# EAGLE design FY (EAGLE 9.6.2)

## Sheet 1 of 7
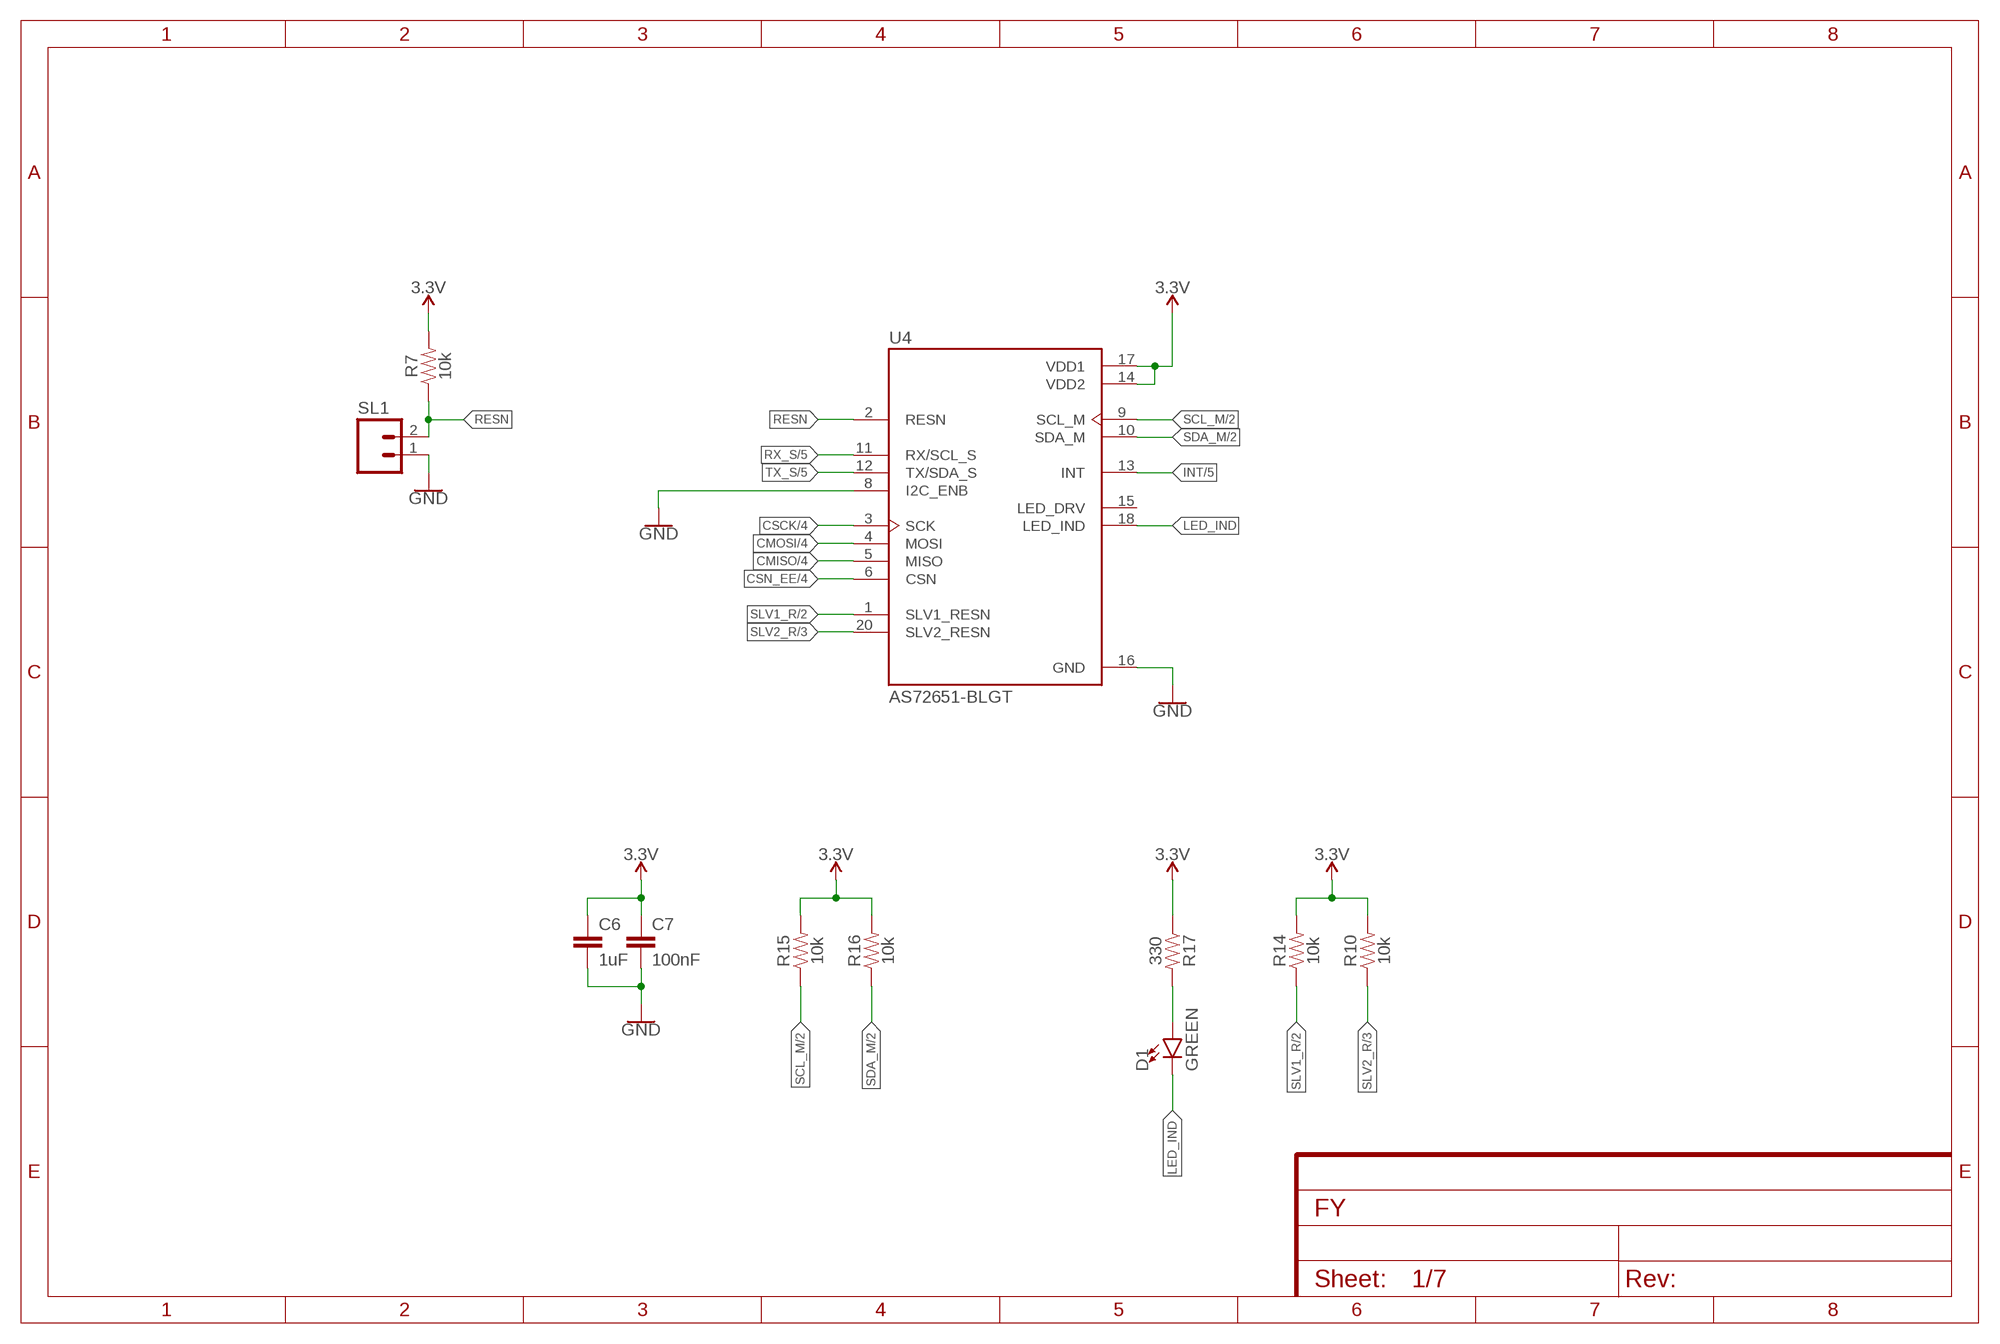
[diagram p0: schematic, sheet 1]

### Parts
C6  1uF  10UF-0603-6.3V-20%  [0603]
C7  100nF  0.1UF-0603-25V-(+80/-20%)  [0603]
D1  GREEN  LED-GREEN0603  [LED-0603]
R7  10k  10KOHM-0603-1/10W-1%  [0603]
R10  10k  10KOHM-0603-1/10W-1%  [0603]
R14  10k  10KOHM-0603-1/10W-1%  [0603]
R15  10k  10KOHM-0603-1/10W-1%  [0603]
R16  10k  10KOHM-0603-1/10W-1%  [0603]
R17  330  10KOHM-0603-1/10W-1%  [0603]
SL1  M02  [02P]
U4  AS72651-BLGT  [PQFN65P470X450X270-20N]

### Nets
3.3V [Power]: C6.1 C7.1 R7.2 R10.2 R14.2 R15.2 R16.2 R17.1 U4.14(VDD2) U4.17(VDD1) ; also sheet 2,3,4,5,6,7
CMISO: U4.5(MISO) ; also sheet 4
CMOSI: U4.4(MOSI) ; also sheet 4
CSCK: U4.3(SCK) ; also sheet 4
CSN_EE: U4.6(CSN) ; also sheet 4
GND: C6.2 C7.2 SL1.1 U4.8(I2C_ENB) U4.16(GND) ; also sheet 2,3,4,5,6,7
INT: U4.13(INT) ; also sheet 5
LED_IND: D1.C U4.18(LED_IND)
N$14: D1.A R17.2
RESN: R7.1 SL1.2 U4.2(RESN)
RX_S: U4.11(RX/SCL_S) ; also sheet 5
SCL_M: R15.1 U4.9(SCL_M) ; also sheet 2,3
SDA_M: R16.1 U4.10(SDA_M) ; also sheet 2,3
SLV1_R: R14.1 U4.1(SLV1_RESN) ; also sheet 2
SLV2_R: R10.1 U4.20(SLV2_RESN) ; also sheet 3
TX_S: U4.12(TX/SDA_S) ; also sheet 5
Unconnected: U4.15(LED_DRV)

## Sheet 2 of 7
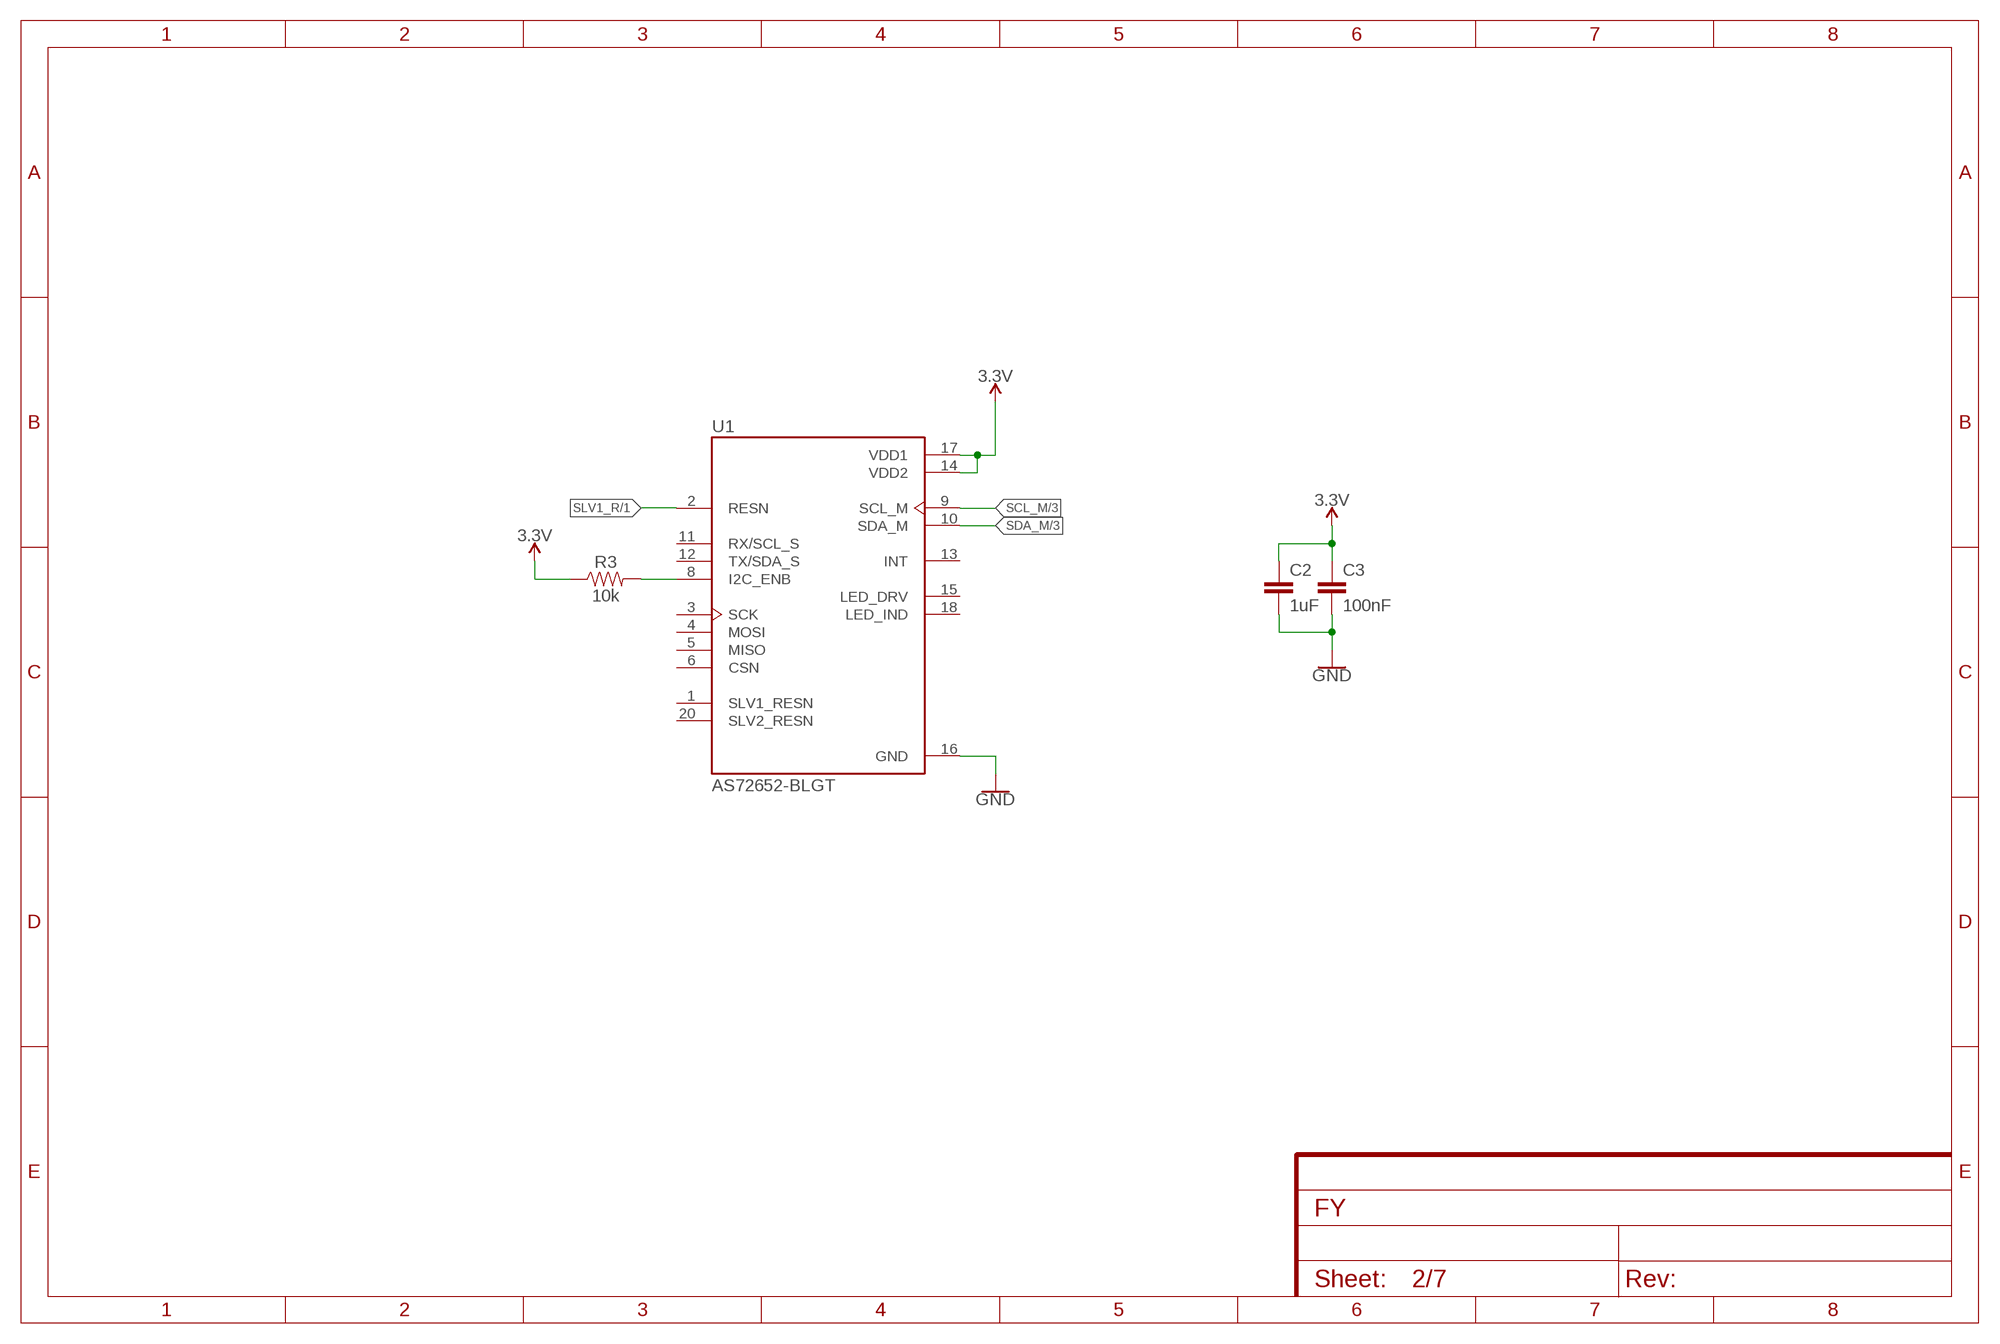
[diagram p1: schematic, sheet 2]

### Parts
C2  1uF  10UF-0603-6.3V-20%  [0603]
C3  100nF  0.1UF-0603-25V-(+80/-20%)  [0603]
R3  10k  0.05OHM-0603-1/5W-1%  [0603]
U1  AS72652-BLGT  AS72651-BLGT  [PQFN65P470X450X270-20N]

### Nets
3.3V [Power]: C2.1 C3.1 R3.1 U1.14(VDD2) U1.17(VDD1) ; also sheet 1,3,4,5,6,7
GND: C2.2 C3.2 U1.16(GND) ; also sheet 1,3,4,5,6,7
N$1: R3.2 U1.8(I2C_ENB)
SCL_M: U1.9(SCL_M) ; also sheet 1,3
SDA_M: U1.10(SDA_M) ; also sheet 1,3
SLV1_R: U1.2(RESN) ; also sheet 1
Unconnected: U1.1(SLV1_RESN) U1.3(SCK) U1.4(MOSI) U1.5(MISO) U1.6(CSN) U1.11(RX/SCL_S) U1.12(TX/SDA_S) U1.13(INT) U1.15(LED_DRV) U1.18(LED_IND) U1.20(SLV2_RESN)

## Sheet 3 of 7
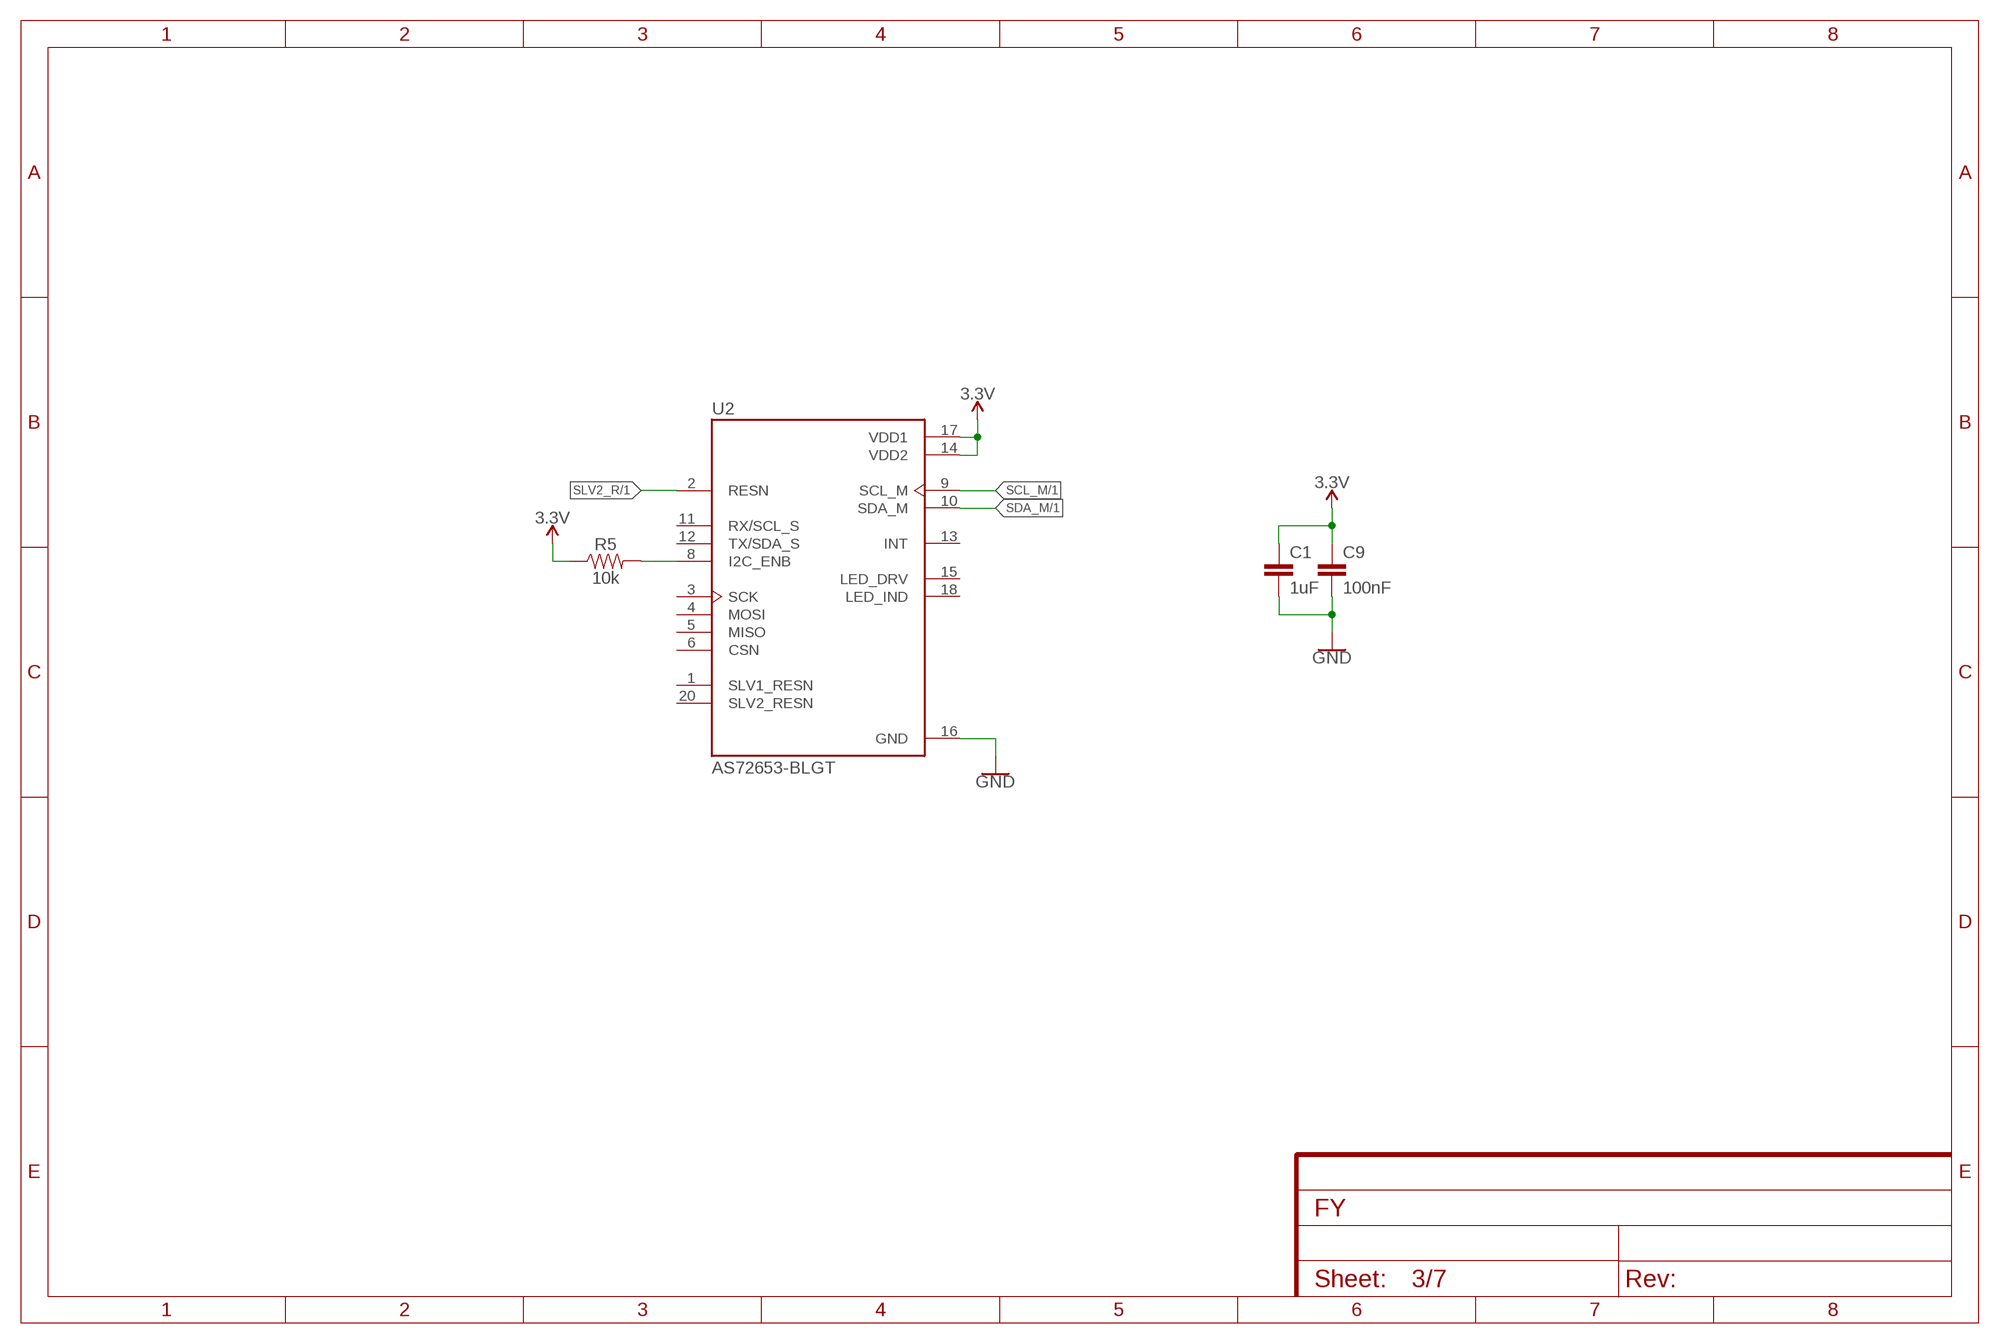
[diagram p2: schematic, sheet 3]

### Parts
C1  1uF  10UF-0603-6.3V-20%  [0603]
C9  100nF  0.1UF-0603-25V-(+80/-20%)  [0603]
R5  10k  0.05OHM-0603-1/5W-1%  [0603]
U2  AS72653-BLGT  AS72651-BLGT  [PQFN65P470X450X270-20N]

### Nets
3.3V [Power]: C1.1 C9.1 R5.1 U2.14(VDD2) U2.17(VDD1) ; also sheet 1,2,4,5,6,7
GND: C1.2 C9.2 U2.16(GND) ; also sheet 1,2,4,5,6,7
N$5: R5.2 U2.8(I2C_ENB)
SCL_M: U2.9(SCL_M) ; also sheet 1,2
SDA_M: U2.10(SDA_M) ; also sheet 1,2
SLV2_R: U2.2(RESN) ; also sheet 1
Unconnected: U2.1(SLV1_RESN) U2.3(SCK) U2.4(MOSI) U2.5(MISO) U2.6(CSN) U2.11(RX/SCL_S) U2.12(TX/SDA_S) U2.13(INT) U2.15(LED_DRV) U2.18(LED_IND) U2.20(SLV2_RESN)

## Sheet 4 of 7
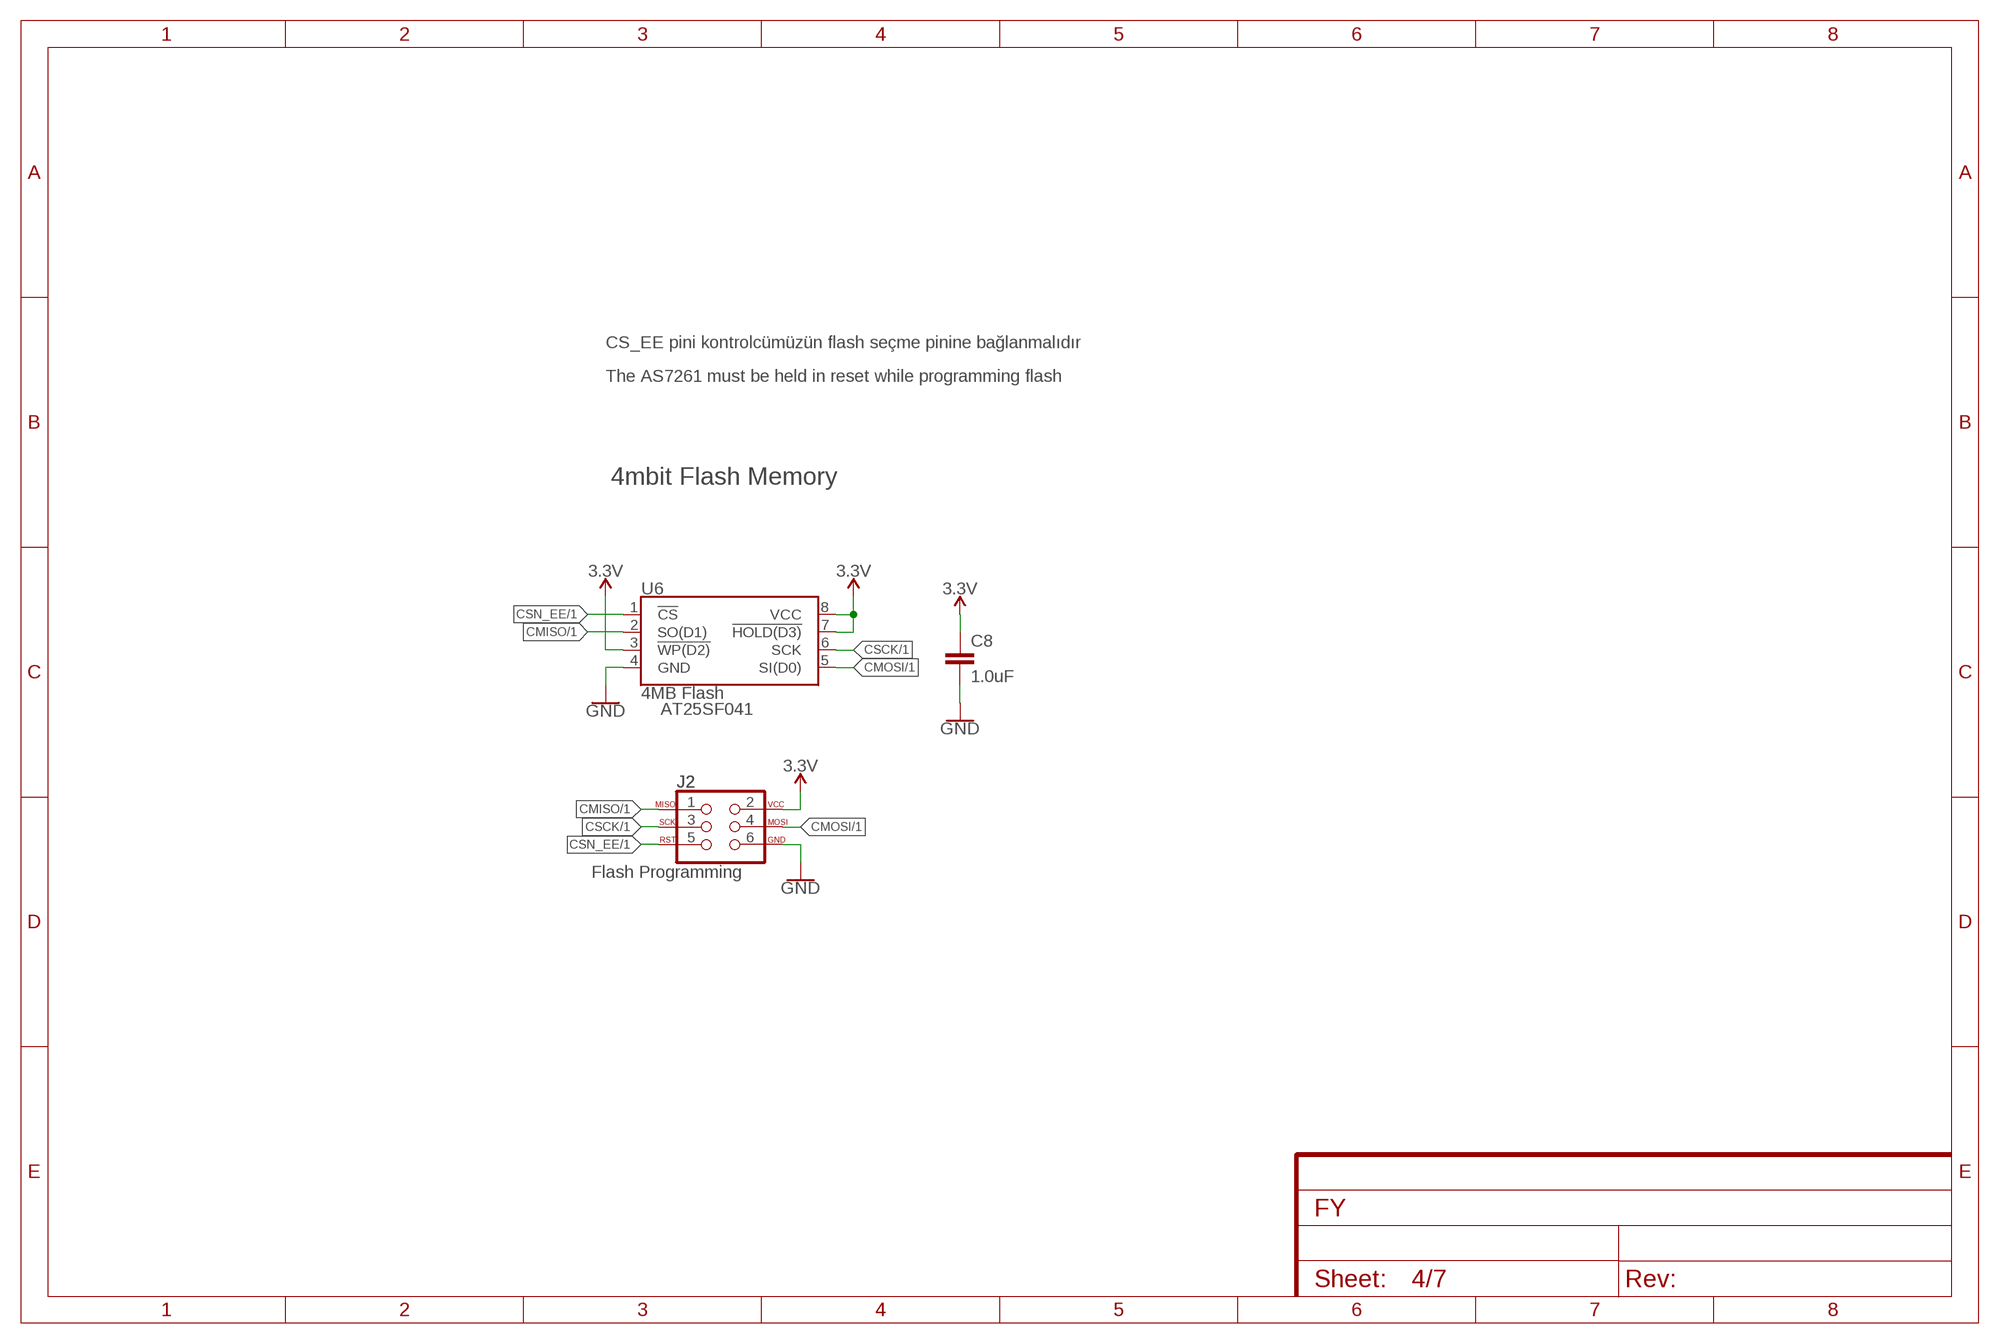
[diagram p3: schematic, sheet 4]

### Parts
C8  1.0uF  1.0UF-0603-16V-10%  [0603]
J2  Flash Programming  AVR_SPI_PROG_3X2TESTPOINTS  [2X3_TEST_POINTS]
U6  4MB Flash  AT25SF041  [SO08]

### Nets
3.3V [Power]: C8.1 J2.2 U6.3(!WP(D2)) U6.7(!HOLD(D3)) U6.8(VCC) ; also sheet 1,2,3,5,6,7
CMISO: J2.1 U6.2(SO(D1)) ; also sheet 1
CMOSI: J2.4 U6.5(SI(D0)) ; also sheet 1
CSCK: J2.3 U6.6(SCK) ; also sheet 1
CSN_EE: J2.5 U6.1(!CS) ; also sheet 1
GND: C8.2 J2.6 U6.4(GND) ; also sheet 1,2,3,5,6,7

### Notes on the sheet
- CS_EE pini kontrolcümüzün flash seçme pinine bağlanmalıdır
- The AS7261 must be held in reset while programming flash
- 4mbit Flash Memory
- AT25SF041

## Sheet 5 of 7
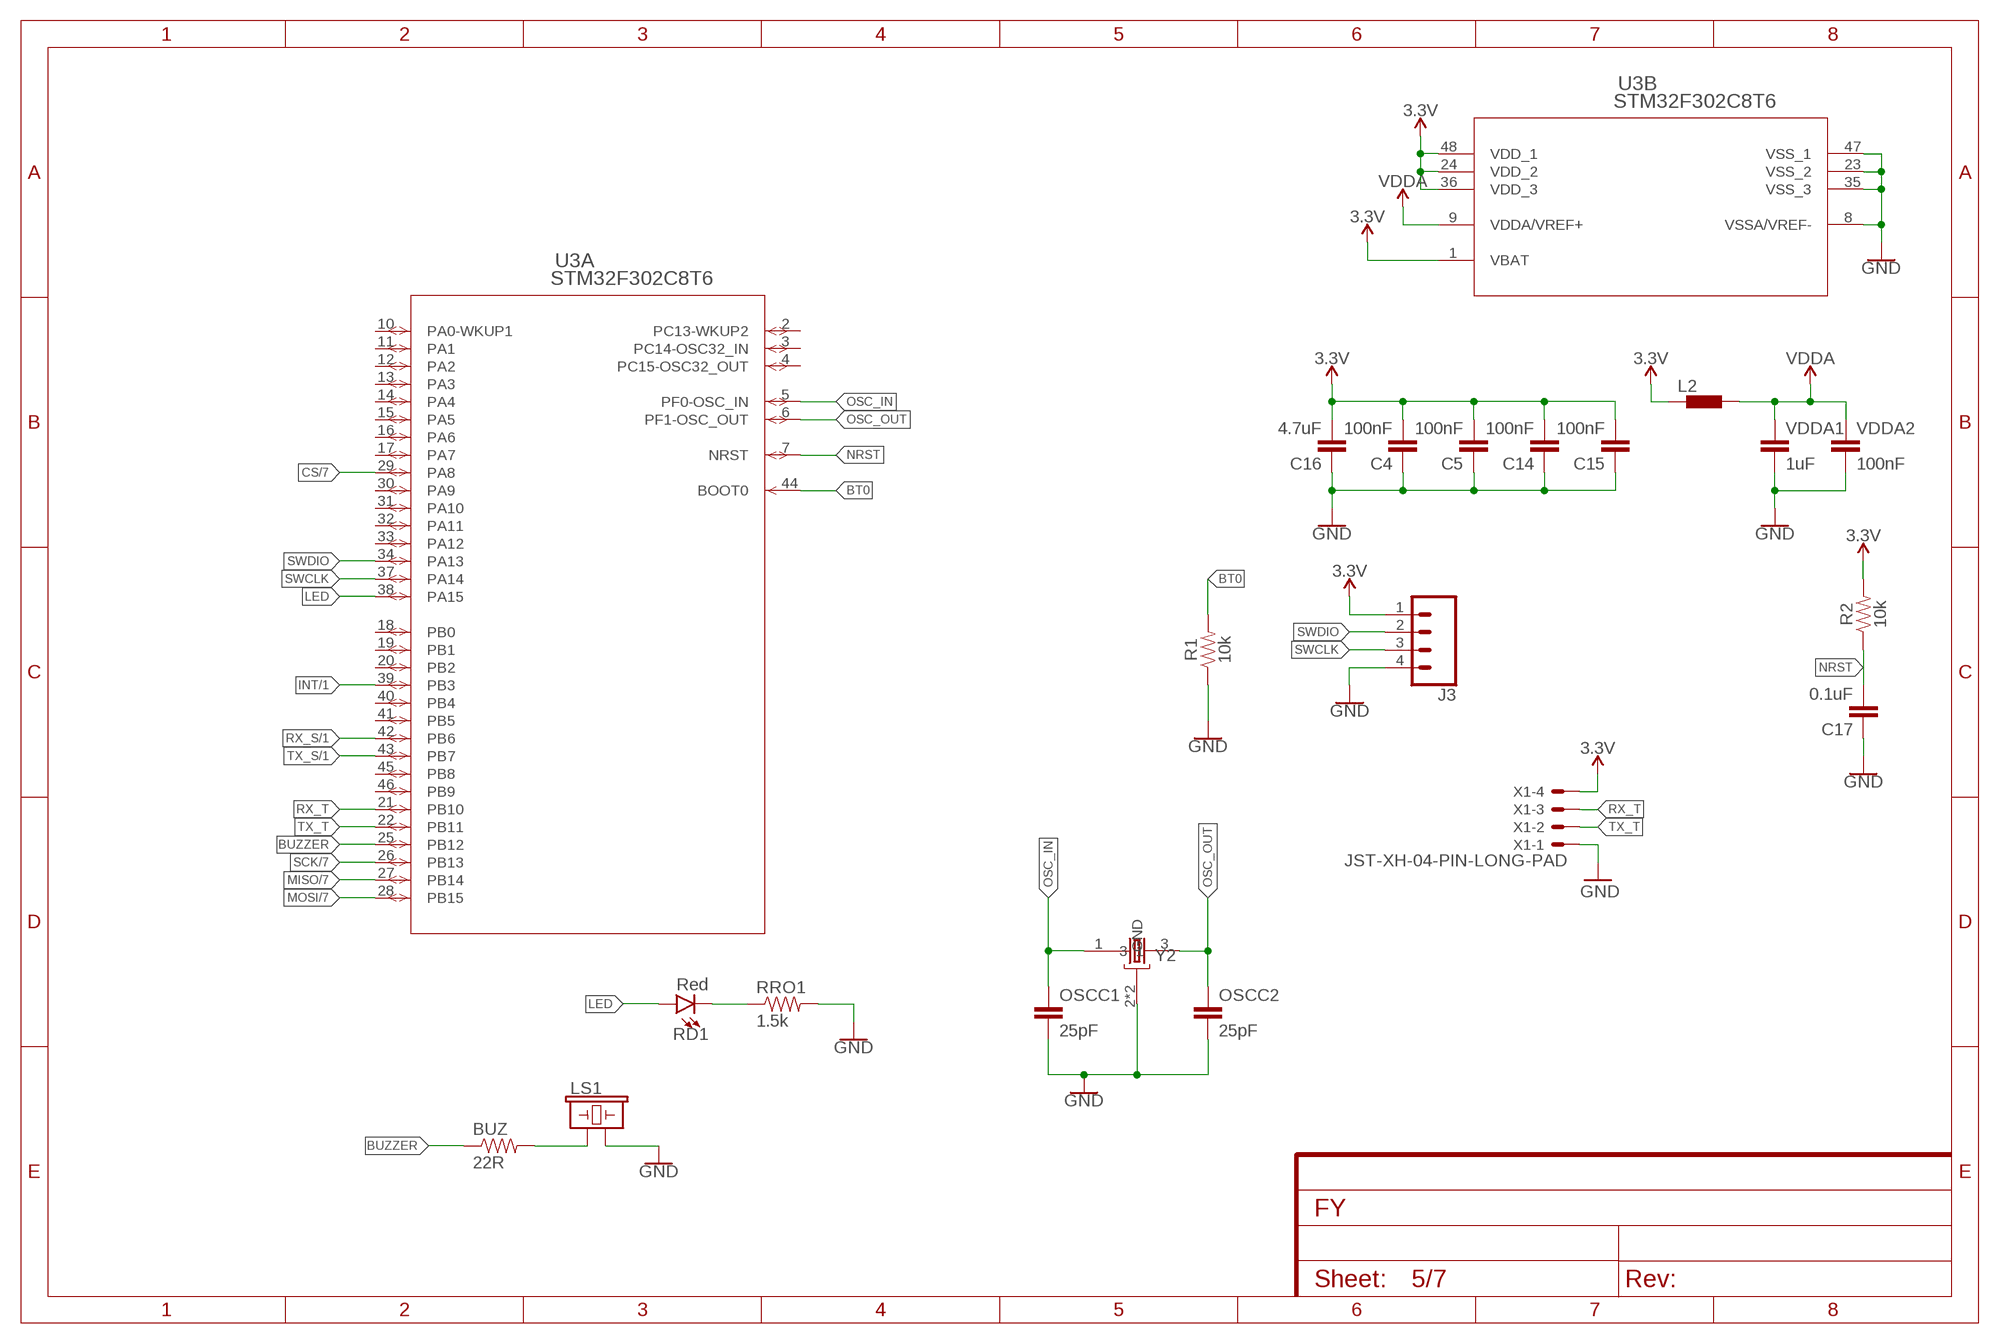
[diagram p4: schematic, sheet 5]

### Parts
BUZ  22R  2.0KOHM1/10W5%(0603)  [0603-RES]
C4  100nF  22PF-0603-50V-5%  [0603]
C5  100nF  22PF-0603-50V-5%  [0603]
C14  100nF  22PF-0603-50V-5%  [0603]
C15  100nF  22PF-0603-50V-5%  [0603]
C16  4.7uF  22PF-0603-50V-5%  [0603]
C17  0.1uF  22PF-0603-50V-5%  [0603]
J3  CONN_04  [1X04]
L2  BLM15HB221SN1  [0402]
LS1  BUZZER-PTH  [BUZZER-12MM]
OSCC1  25pF  0.1UF-0603-25V-(+80/-20%)  [0603]
OSCC2  25pF  0.1UF-0603-25V-(+80/-20%)  [0603]
R1  10k  0.05OHM-0603-1/5W-1%  [0603]
R2  10k  0.05OHM-0603-1/5W-1%  [0603]
RD1  Red  LED-RED0603-SMART  [LED-0603]
RRO1  1.5k  2.0KOHM1/10W5%(0603)  [0603-RES]
U3  STM32F302C8T6  [LQFP48-7X7MM]
VDDA1  1uF  0.1UF-0603-25V-(+80/-20%)  [0603]
VDDA2  100nF  0.1UF-0603-25V-(+80/-20%)  [0603]
X1  JST-XH-04-PIN-LONG-PAD  [JST-XH-04-PACKAGE-LONG-PAD]
Y2  ABM2B-8.000MHZ-10-1-U-T  ABM3B-26.000MHZ-10-1-U-T  [OSCCC500X320X110-4N]

### Nets
3.3V [Power]: C4.2 C5.2 C14.2 C15.2 C16.2 J3.1 L2.1 R2.2 U3.1(B:VBAT) U3.24(B:VDD_2) U3.36(B:VDD_3) U3.48(B:VDD_1) X1.4 ; also sheet 1,2,3,4,6,7
BT0: R1.2 U3.44(A:BOOT0)
BUZZER: BUZ.1 U3.25(A:PB12)
CS: U3.29(A:PA8) ; also sheet 7
GND: C4.1 C5.1 C14.1 C15.1 C16.1 C17.1 J3.4 LS1.- OSCC1.2 OSCC2.2 R1.1 RRO1.2 U3.8(B:VSSA/VREF-) U3.23(B:VSS_2) U3.35(B:VSS_3) U3.47(B:VSS_1) VDDA1.2 VDDA2.2 X1.1 Y2.2(GND) Y2.4(GND) ; also sheet 1,2,3,4,6,7
INT: U3.39(A:PB3) ; also sheet 1
LED: RD1.A U3.38(A:PA15)
MISO: U3.27(A:PB14) ; also sheet 7
MOSI: U3.28(A:PB15) ; also sheet 7
N$2: RD1.C RRO1.1
N$13: BUZ.2 LS1.+
NRST: C17.2 R2.1 U3.7(A:NRST)
OSC_IN: OSCC1.1 U3.5(A:PF0-OSC_IN) Y2.1
OSC_OUT: OSCC2.1 U3.6(A:PF1-OSC_OUT) Y2.3
RX_S: U3.42(A:PB6) ; also sheet 1
RX_T: U3.21(A:PB10) X1.3
SCK: U3.26(A:PB13) ; also sheet 7
SWCLK: J3.3 U3.37(A:PA14)
SWDIO: J3.2 U3.34(A:PA13)
TX_S: U3.43(A:PB7) ; also sheet 1
TX_T: U3.22(A:PB11) X1.2
VDDA: L2.2 U3.9(B:VDDA/VREF+) VDDA1.1 VDDA2.1
Unconnected: U3.2(A:PC13-WKUP2) U3.3(A:PC14-OSC32_IN) U3.4(A:PC15-OSC32_OUT) U3.10(A:PA0-WKUP1) U3.11(A:PA1) U3.12(A:PA2) U3.13(A:PA3) U3.14(A:PA4) U3.15(A:PA5) U3.16(A:PA6) U3.17(A:PA7) U3.18(A:PB0) U3.19(A:PB1) U3.20(A:PB2) U3.30(A:PA9) U3.31(A:PA10) U3.32(A:PA11) U3.33(A:PA12) U3.40(A:PB4) U3.41(A:PB5) U3.45(A:PB8) U3.46(A:PB9)

## Sheet 6 of 7
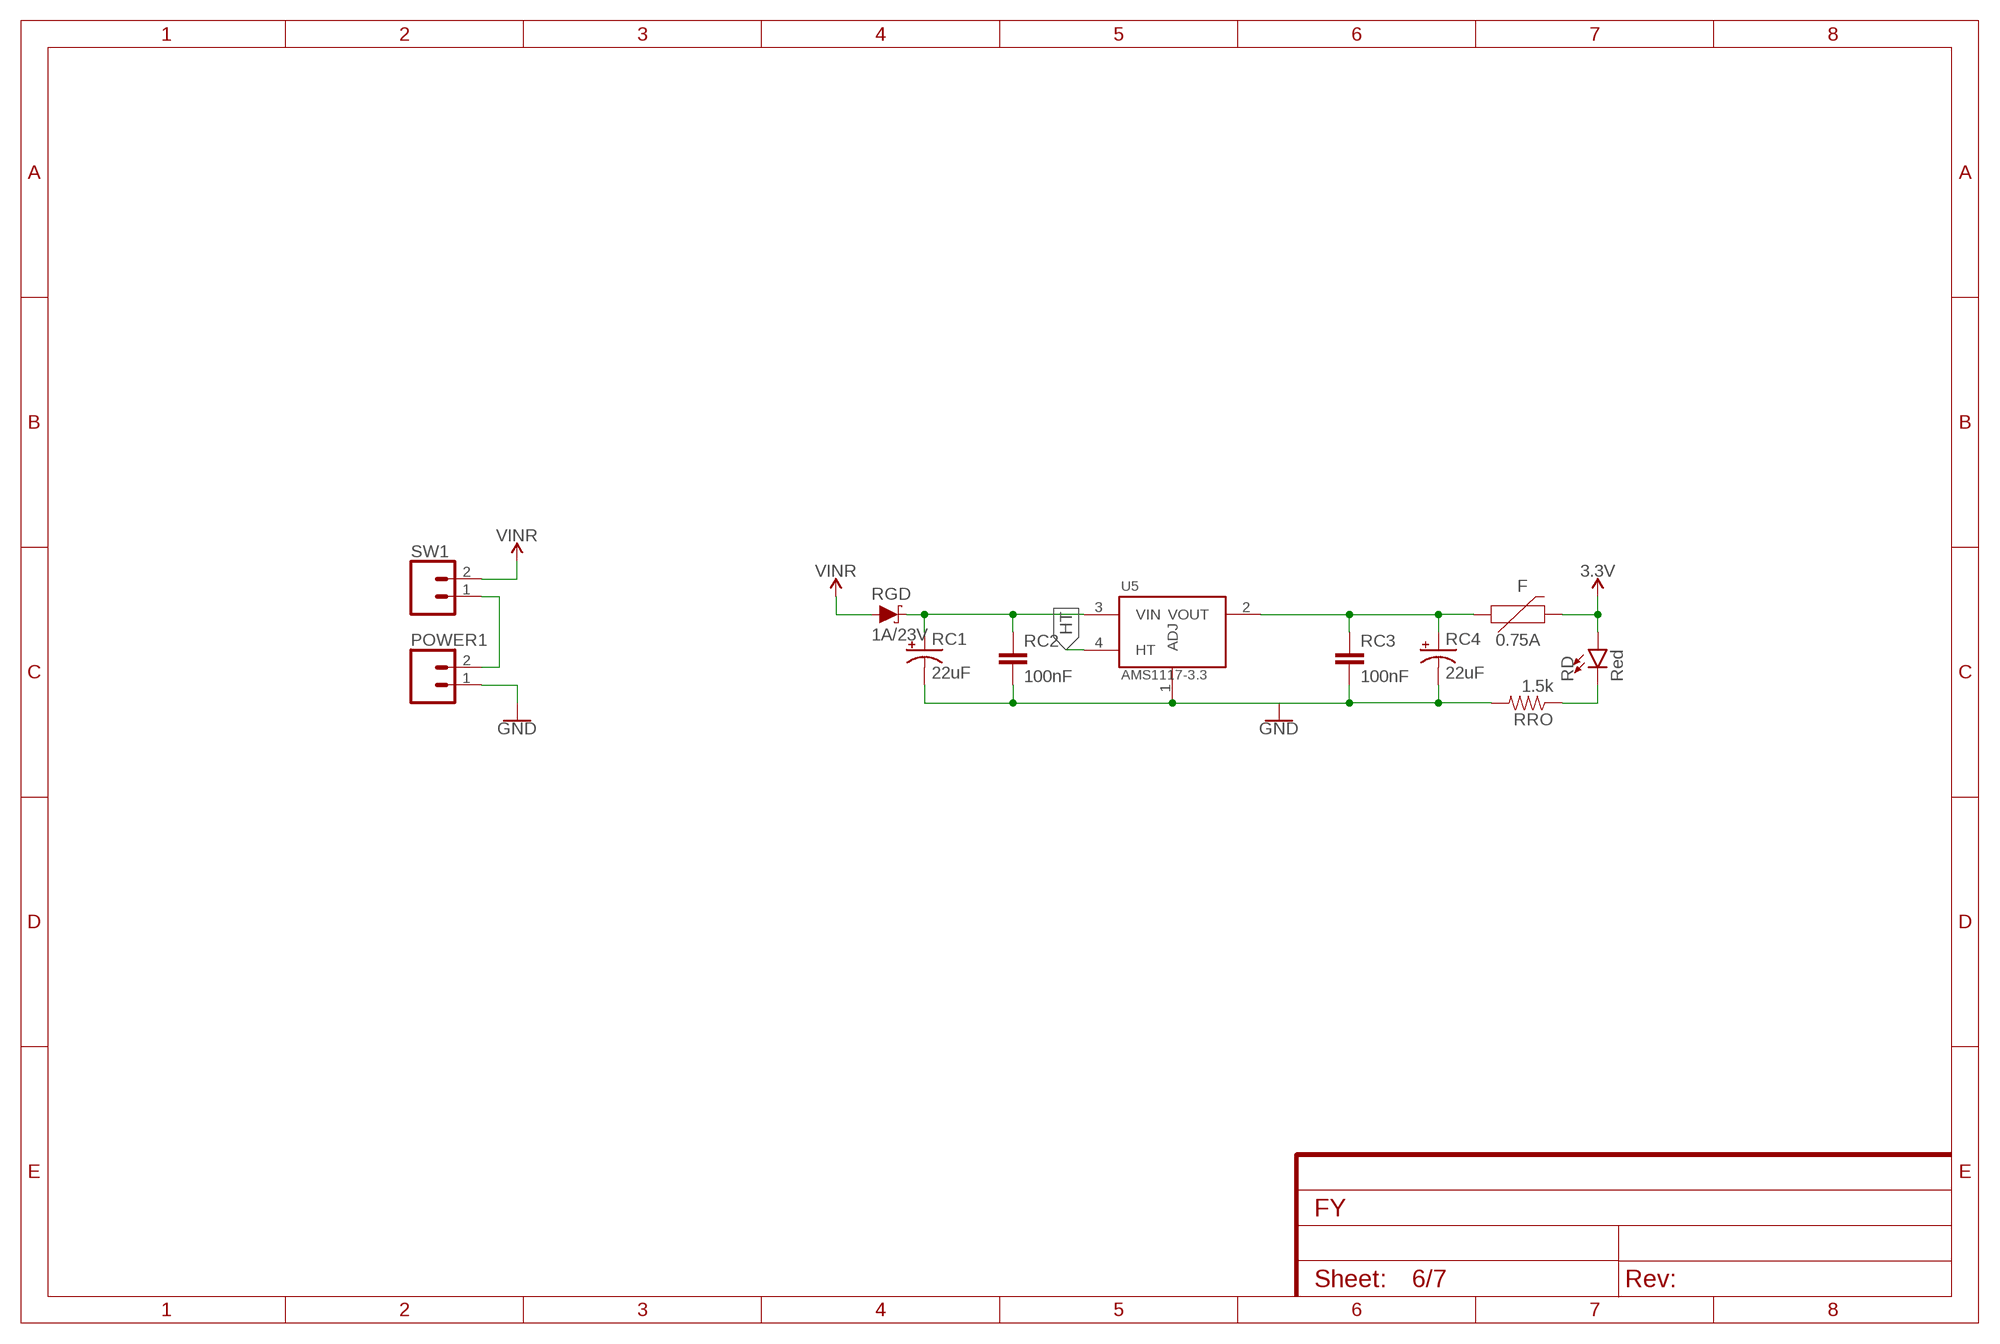
[diagram p5: schematic, sheet 6]

### Parts
F  0.75A  PPTC_THREE-QUARTER-AMP  [1206]
POWER1  CONN_023.5MM-NO_SILK  [SCREWTERMINAL-3.5MM-2-NS]
RC1  22uF  10UF-POLAR-EIA3528-20V-10%(TANT)  [EIA3528]
RC2  100nF  0.1UF-0603-25V-(+80/-20%)  [0603]
RC3  100nF  0.1UF-0603-25V-(+80/-20%)  [0603]
RC4  22uF  10UF-POLAR-EIA3528-20V-10%(TANT)  [EIA3528]
RD  Red  LED-RED0603-SMART  [LED-0603]
RGD  1A/23V  DIODE-SCHOTTKY-BAT20J  [SOD-323]
RRO  1.5k  2.0KOHM1/10W5%(0603)  [0603-RES]
SW1  CONN_023.5MM-NO_SILK  [SCREWTERMINAL-3.5MM-2-NS]
U5  AMS1117-3.3  [SOT229P700X180-4N]

### Nets
3.3V [Power]: F.2 RD.A ; also sheet 1,2,3,4,5,7
GND: POWER1.1 RC1.C(-) RC2.2 RC3.2 RC4.C(-) RRO.2 U5.1(ADJ) ; also sheet 1,2,3,4,5,7
HT: U5.4(HT)
N$3: POWER1.2 SW1.1
N$6: F.1 RC3.1 RC4.A(+) U5.2(VOUT)
N$11: RD.C RRO.1
VIN: RGD.A SW1.2 ; supply symbol labelled VINR
VNR: RC1.A(+) RC2.1 RGD.C U5.3(VIN)

## Sheet 7 of 7
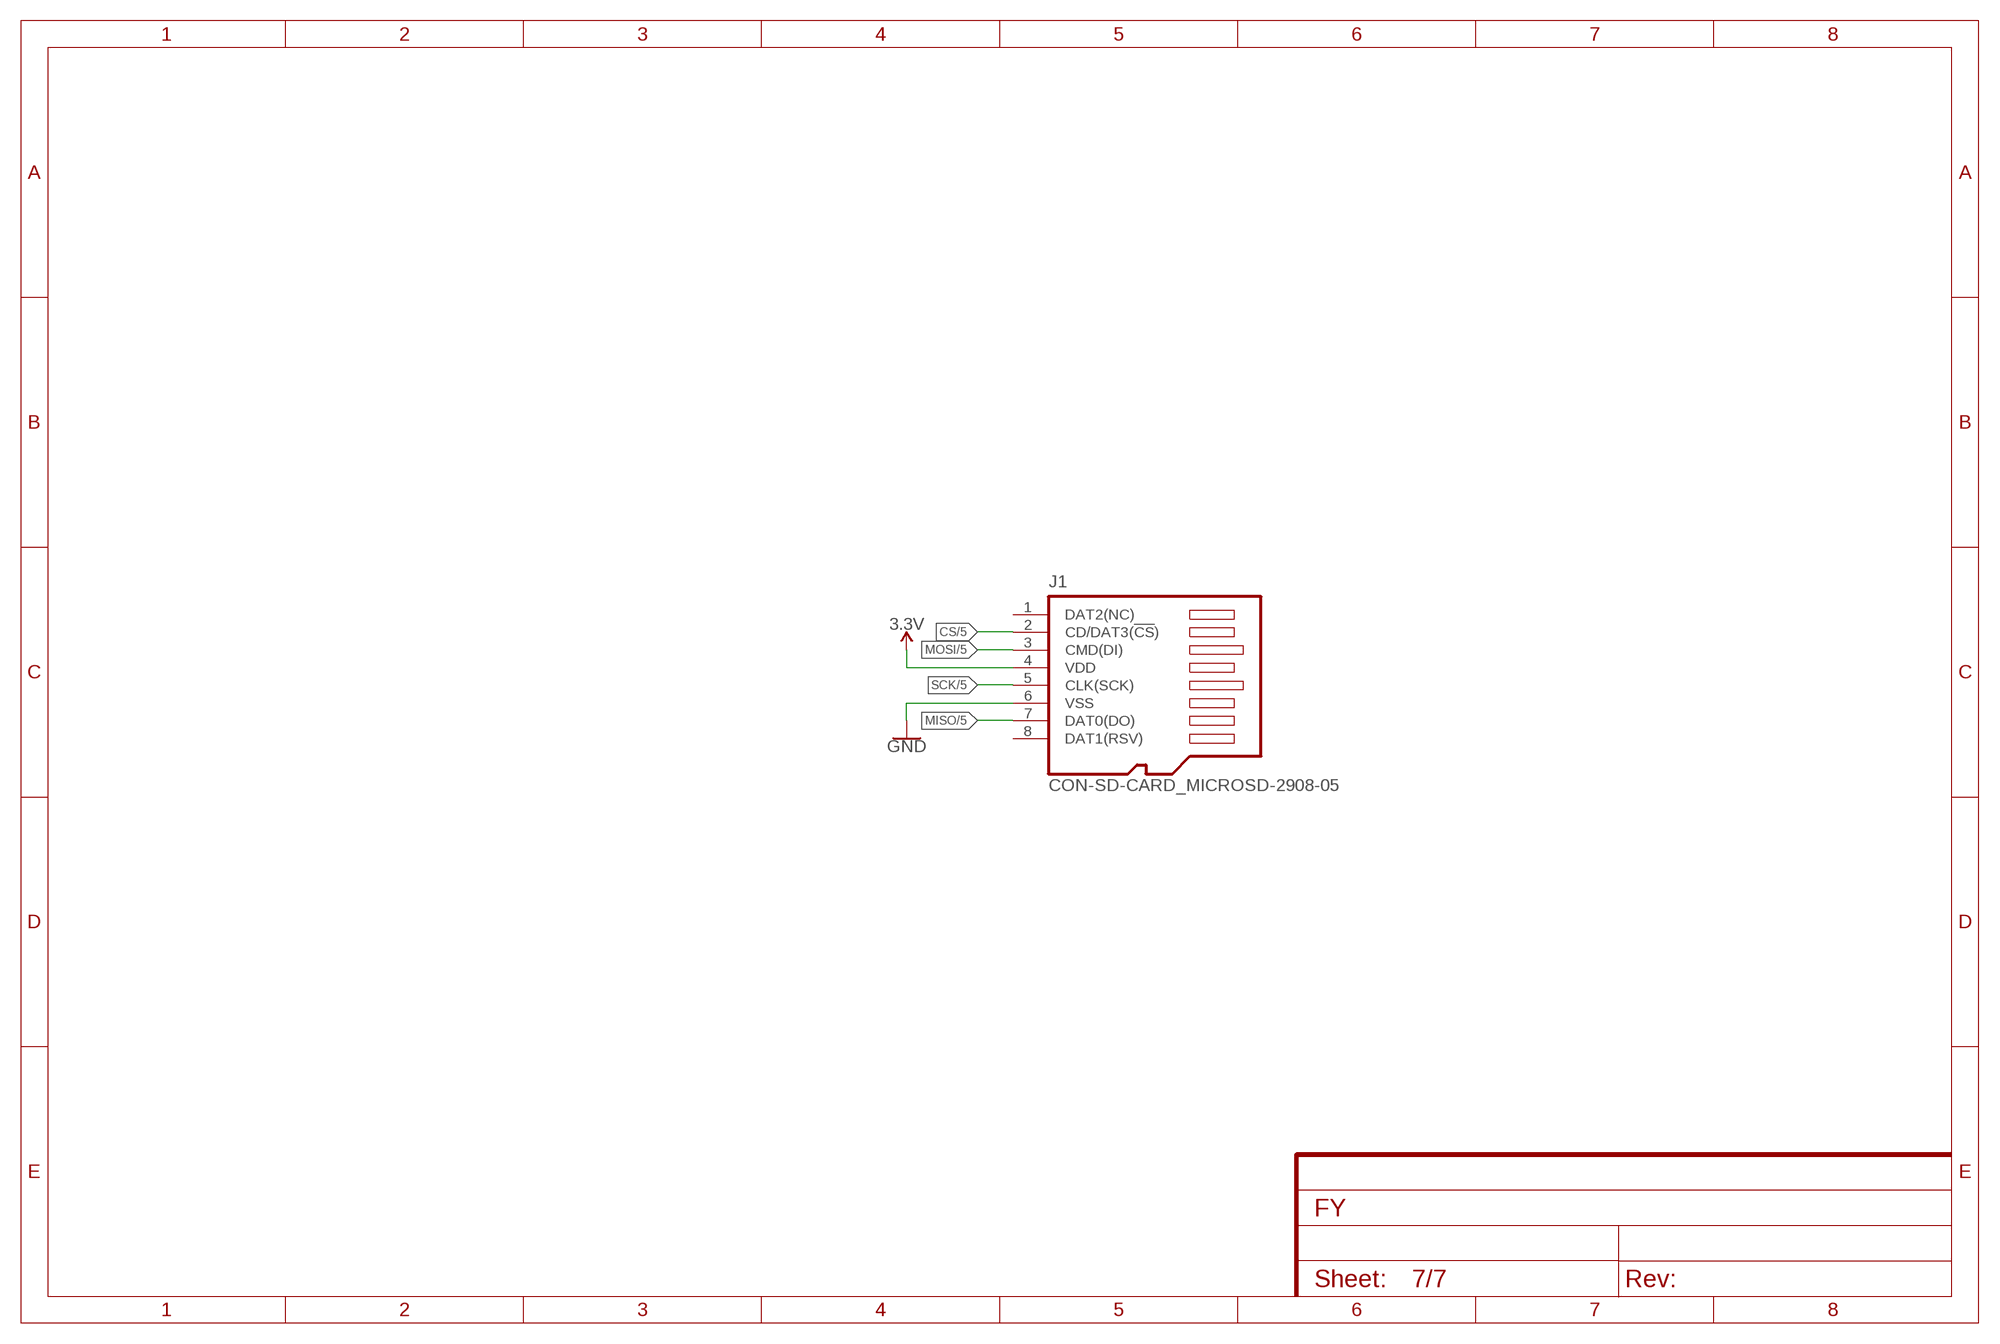
[diagram p6: schematic, sheet 7]

### Parts
J1  CON-SD-CARD_MICROSD-2908-05  [CON-SD-CARD_2908-05]

### Nets
3.3V [Power]: J1.4(VDD) ; also sheet 1,2,3,4,5,6
CS: J1.2(CD/DAT3(!CS!)) ; also sheet 5
GND: J1.6(VSS) ; also sheet 1,2,3,4,5,6
MISO: J1.7(DAT0(DO)) ; also sheet 5
MOSI: J1.3(CMD(DI)) ; also sheet 5
SCK: J1.5(CLK(SCK)) ; also sheet 5
Unconnected: J1.1(DAT2(NC)) J1.8(DAT1(RSV)) J1.GND@1(GND) J1.GND@2(GND) J1.GND@3(GND) J1.GND@4(GND)

## Library data of the parts
BUZ RRO RRO1 = SparkFun-Resistors:2.0KOHM1/10W5%(0603): RES-08296; PROD_ID: RES-08296; VALUE: 2.0k
C1 C2 C6 = SparkFun-Capacitors:10UF: 10.0µF ceramic capacitors A capacitor is a passive two-terminal electrical component used to store electrical energy temporarily in an electric field.; PROD_ID: CAP-11015; VALUE: 10uF
C3 C7 C9 OSCC1 OSCC2 RC2 RC3 VDDA1 VDDA2 = SparkFun-Capacitors:0.1UF: 0.1µF ceramic capacitors A capacitor is a passive two-terminal electrical component used to store electrical energy temporarily in an electric field.; PROD_ID: CAP-00810; VALUE: 0.1uF
C4 C5 C14-C17 = SparkFun-Capacitors:22PF: 22pF ceramic capacitors A capacitor is a passive two-terminal electrical component used to store electrical energy temporarily in an electric field.; PROD_ID: CAP-07876; VALUE: 22pF
C8 = SparkFun-Capacitors:1.0UF: 1µF ceramic capacitors A capacitor is a passive two-terminal electrical component used to store electrical energy temporarily in an electric field.; PROD_ID: CAP-00868
D1 = SparkFun-LED:LED-GREEN: Green SMD LED Used in manufacturing of various products at SparkFun Packages: 0603 - SMD 0603 package [Product Link] <http://www.futureelectronics.com/en/technologies/semiconductors/optoelectronics/leds/Pages/9894312-LTST-C190GKT.aspx?CrossPart=HSMG-C190&IM=0> LilyPad 1206 - SMD1206 LilyPad package [Product Link] <http://www.futureelectronics.com/en/Technologies/Product.aspx?ProductID=IN150NGHARVATEKCORPORATION2049943&IM=0> 1206 - SMD1206 package [Product Link] <http://www.futureelectronics.com/en/technologies/semiconductors/optoelectronics/leds/Pages/8315665-LTST-C150KGKT.aspx?IM=0> 1206 Bottom Mount -SMD 1206 Bottom Mount [Product Link] <http://www.digikey.com/product-detail/en/lite-on-inc/LTST-C230KGKT/160-1456-1-ND/386854> SparkFun Products: Pro Mini 328 -5V <https://www.sparkfun.com/products/821> RedBoard <https://www.sparkfun.com/products/12757> MP3 Trigger <https://www.sparkfun.com/products/13720> Makey Makey <https://www.sparkfun.com/products/11076>; PROD_ID: DIO-00821
F = SparkFun-Fuses:PPTC: Resettable Fuse PPTC Resettable Fuse. Really a sort of resistor with a polymeric positive temperature coefficient whose resistance increases dramatically with an increase in temperature. When heated by the power passing through the resistance rises causing the current to be limited, protecting the circuit. This is achieved by the transition of the polymer from a crystalline to an amorphous state where the conductive carbon separates breaking the conductive pathways found in the cool crystalline structure. When a PPTC cools back down it resumes conducting letting the circuit turn back on. SparkFun Products: SparkFun RedBoard - Programmed with Arduino <https://www.sparkfun.com/products/12757> Pro Micro - 5V/16MHz <https://www.sparkfun.com/products/12640> Arduino Pro 328 - 5V/16MHz <https://www.sparkfun.com/products/10915> MP3 Trigger <https://www.sparkfun.com/products/13720>; PROD_ID: RES-11150; VALUE: 6V/0.75A
J1 = 52101-101-REV-A_v16:CON-SD-CARD_MICROSD-: microSD Connector
J2 = SparkFun-Connectors:AVR_SPI_PROG_3X2: AVR ISP 6 Pin This is the reduced ISP connector for AVR programming. Common on Arduino. This footprint will take up less PCB space and can be used with a 10-pin to 6-pin adapter such as SKU: BOB-08508 **Special note about "TEST_POINT" package. The stop mask is on the top side, so if you want your programming test points to be on the bottom of your board, make sure to place this package on the bottom side of the board. This also ensure that the orientation to program from the bottom side will be correct. SparkFun Products: SparkFun ISP Pogo Adapter <https://www.sparkfun.com/products/11591> - NS Tiny AVR Programmer <https://www.sparkfun.com/products/11801> -PTH
J3 = SparkFun-Connectors:CONN_04: Multi connection point. Often used as Generic Header-pin footprint for 0.1 inch spaced/style header connections On any of the 0.1 inch spaced packages, you can populate with these: Break Away Headers - Straight <https://www.sparkfun.com/products/116> (PRT-00116) Break Away Male Headers - Right Angle <https://www.sparkfun.com/products/553> (PRT-00553) Female Headers <https://www.sparkfun.com/products/115> (PRT-00115) Break Away Headers - Machine Pin <https://www.sparkfun.com/products/117> (PRT-00117) Break Away Female Headers - Swiss Machine Pin <https://www.sparkfun.com/products/743> (PRT-00743) For SCREWTERMINALS and SPRING TERMINALS visit here: Screw Terimnals on SparkFun.com <https://www.sparkfun.com/search/results?term=Screw+Terminals> (5mm/3.5mm/2.54mm spacing) This device is also useful as a general connection point to wire up your design to another part of your project. Our various solder wires solder well into these plated through hole pads. Hook-Up Wire - Assortment (Stranded, 22 AWG) <https://www.sparkfun.com/products/11375> (PRT-11375) Hook-Up Wire - Assortment (Solid Core, 22 AWG) <https://www.sparkfun.com/products/11367> (PRT-11367) View the entire wire category on our website here <https://www.sparkfun.com/categories/141> Special notes: Molex polarized connector foot print use with SKU : PRT-08231 with associated crimp pins and housings. 1MM SMD Version SKU: PRT-10208; PROD_ID: CONN-09696
L2 = inductors:BLM15H: EMIFIL (R) Chip Ferrite Bead for GHz Noise Source: http://www.murata.com/ Ferrite Bead BLM15H.pdf; ORDER_URL: https://eu.mouser.com/ProductDetail/Murata-Electronics/NFZ15SR152SN10D?qs=rkhjVJ6%2F3EK7NITaH%252B9%252Bxg%3D%3D
LS1 = SparkFun-Electromechanical:BUZZER: Buzzer Small round buzzers that operate around the audible 2kHz range. You can use these as speakers to create simple music or user interfaces. Variant Overview: PTH - Mini Speaker - PC Mount 12mm 2.048kHz <https://www.sparkfun.com/products/7950> PTH_KIT - Mini Speaker - PC Mount 12mm 2.048kHz <https://www.sparkfun.com/products/7950> KIT simplifies soldering by adding stop mask to one side of the pads. PTH_NO_SILK - Mini Speaker - PC Mount 12mm 2.048kHz <https://www.sparkfun.com/products/7950> No silkscreen indicator of buzzer outline. PTH_KIT_NO_SILK - Mini Speaker - PC Mount 12mm 2.048kHz <https://www.sparkfun.com/products/7950> KIT package w/o silkscreen SMD - Buzzer Audio Magnetic (CCV-084B16) SMD buzzer used on, e.g. the LilyPad Buzzer <https://www.sparkfun.com/products/8463> and RFID USB Reader <https://www.sparkfun.com/products/9963>. SMD_KIT - Buzzer Audio Magnetic (CCV-084B16) SMD Buzzer with elongated pins to make soldering easier. Used on the SparkFun Simon Says - Surface Mount Soldering Kit <https://www.sparkfun.com/products/10935>.; PROD_ID: COMP-08253; SF_SKU: COM-07950
POWER1 SW1 = SparkFun-Connectors:CONN_02: Multi connection point. Often used as Generic Header-pin footprint for 0.1 inch spaced/style header connections On any of the 0.1 inch spaced packages, you can populate with these: Break Away Headers - Straight <https://www.sparkfun.com/products/116> (PRT-00116) Break Away Male Headers - Right Angle <https://www.sparkfun.com/products/553> (PRT-00553) Female Headers <https://www.sparkfun.com/products/115> (PRT-00115) Break Away Headers - Machine Pin <https://www.sparkfun.com/products/117> (PRT-00117) Break Away Female Headers - Swiss Machine Pin <https://www.sparkfun.com/products/743> (PRT-00743) For SCREWTERMINALS and SPRING TERMINALS visit here: Screw Terimnals on SparkFun.com <https://www.sparkfun.com/search/results?term=Screw+Terminals> (5mm/3.5mm/2.54mm spacing) This device is also useful as a general connection point to wire up your design to another part of your project. Our various solder wires solder well into these plated through hole pads. Hook-Up Wire - Assortment (Stranded, 22 AWG) <https://www.sparkfun.com/products/11375> (PRT-11375) Hook-Up Wire - Assortment (Solid Core, 22 AWG) <https://www.sparkfun.com/products/11367> (PRT-11367) View the entire wire category on our website here <https://www.sparkfun.com/categories/141> Special notes: Molex polarized connector foot print use with: PRT-08233 with associated crimp pins and housings. 2.54_SCREWTERM for use with PRT-10571. 3.5mm Screw Terminal footprints for PRT-08084 5mm Screw Terminal footprints for use with PRT-08432; PROD_ID: CONN-08399
R1-R3 R5 = SparkFun-Resistors:0.05OHM: 0.05Ω resistor A resistor is a passive two-terminal electrical component that implements electrical resistance as a circuit element. Resistors act to reduce current flow, and, at the same time, act to lower voltage levels within circuits. - Wikipedia; PROD_ID: RES-12535; VALUE: 0.05
R7 R10 R14-R16 = SparkFun-Resistors:10KOHM: 10kΩ resistor A resistor is a passive two-terminal electrical component that implements electrical resistance as a circuit element. Resistors act to reduce current flow, and, at the same time, act to lower voltage levels within circuits. - Wikipedia; PROD_ID: RES-00824
R17 = SparkFun-Resistors:10KOHM: 10kΩ resistor A resistor is a passive two-terminal electrical component that implements electrical resistance as a circuit element. Resistors act to reduce current flow, and, at the same time, act to lower voltage levels within circuits. - Wikipedia; PROD_ID: RES-00824; VALUE: 10k
RC1 RC4 = SparkFun-Capacitors:10UF-POLAR: 10.0µF polarized capacitors A capacitor is a passive two-terminal electrical component used to store electrical energy temporarily in an electric field.; PROD_ID: CAP-08063; VALUE: 10uF
RD RD1 = SparkFun-LED:LED-RED: Red SMD LED Used in manufacturing of most products at SparkFun Packages: 0603 - SMD 0603 package [Product Link] <http://docs.avagotech.com/docs/AV02-0551EN> 0603 SMART - SMD 0603 SMART package ( more efficient and expensive)[Product Link] <http://www.osram-os.com/Graphics/XPic2/00077099_0.pdf> 1206 - SMD1206 package [Product Link] <https://www.sparkfun.com/datasheets/DevTools/LilyPad/Q150OVS4.pdff> SparkFun Products: Pro Mini 328 -5V <https://www.sparkfun.com/products/821> RedBoard <https://www.sparkfun.com/products/12757> IOIO-OTG <https://www.sparkfun.com/products/13613>; PROD_ID: DIO-11154
RGD = SparkFun-DiscreteSemi:DIODE-SCHOTTKY: Schottky diode A Schottky diode is a semiconductor diode which has a low forward voltage drop and a very fast switching action.; PROD_ID: DIO-11623; VALUE: 1A/23V/620mV
SL1 = con-amp-quick:M02: AMP QUICK CONNECTOR; OC_FARNELL: unknown; OC_NEWARK: unknown
U1 U2 U4 = AS7265X-BLGT:AS72651-BLGT: Digital 6-channel multi-spectral sensor (near IR light wavelengths) Check prices <https://pricing.snapeda.com/parts/AS72651-BLGT/ams/view-part?ref=eda>; AVAILABILITY: Warning; DESCRIPTION: AS72651-BLGT LGA20 LF T&RDP; MF: ams; MP: AS72651-BLGT; PACKAGE: LGA-20 ams; PRICE: None
U3 = STM32F302C8T6:STM32F302C8T6; BUILT_BY: EMA_UL_Team; COPYRIGHT: Copyright (C) 2018 Accelerated Designs. All rights reserved; MANUFACTURER_PART_NUMBER: STM32F302C8T6; SOURCELIBRARY: Updates_to_database_2020-10-19; VENDOR: STMicroelectronics
U5 = AMS1117-3.3:AMS1117-3.3: Sot223/Pkg 1-Amp 3.3-Volt Low Drop Out Voltage Regulatator; AVAILABILITY: Unavailable; DESCRIPTION: Sot223/Pkg 1-Amp 3.3-Volt Low Drop Out Voltage Regulatator; MF: Advanced Monolithic Systems; MP: AMS1117-3.3; PACKAGE: SOT-89 ams; PRICE: None
U6 = SparkFun-IC-Memory:AT25SF041: AT25SF041 4Mb Serial Flash Memory 104MHz, SPI, 8-SOIC Datasheet <http://www.adestotech.com/wp-content/uploads/DS-AT25SF041_044.pdf> SparkFun Products: SparkFun ESP8266 Thing <https://www.sparkfun.com/products/13231> SparkFun ESP8266 Thing - Dev Board <https://www.sparkfun.com/products/13711>; ORDER_URL: https://eu.mouser.com/ProductDetail/Adesto-Technologies/AT25SF041B-SHB-T?qs=wnTfsH77Xs7aj0PSgtTkzg%3D%3D; PROD_ID: IC-12455
X1 = Rembrandt Electronics - JST XH Connectors v1-0:JST-XH-04-PIN: JST XH Connector 2 Pin Wire to board connector. Pitch: 2,54 mm, (0.100") Number of pins: 4 Created by Rembrandt Electronics www.rembrandtelectronics.com
Y2 = ABM3B-26.000MHZ-10-1-U-T:ABM3B-26.000MHZ-10-1-U-T: Ceramic SMD Crystal Check prices <https://pricing.snapeda.com/parts/ABM3B-26.000MHZ-10-1-U-T/Abracon/view-part?ref=eda>; AVAILABILITY: Good; DESCRIPTION: 26MHz ±10ppm Crystal 10pF 50 Ohms 4-SMD, No Lead; MF: Abracon; MP: ABM3B-26.000MHZ-10-1-U-T; PACKAGE: SMD-4 Abracon LLC; PRICE: None; PURCHASE-URL: https://pricing.snapeda.com/search/part/ABM3B-26.000MHZ-10-1-U-T/?ref=eda

## Net classes
1 Power: width 0.305 mm

## Board
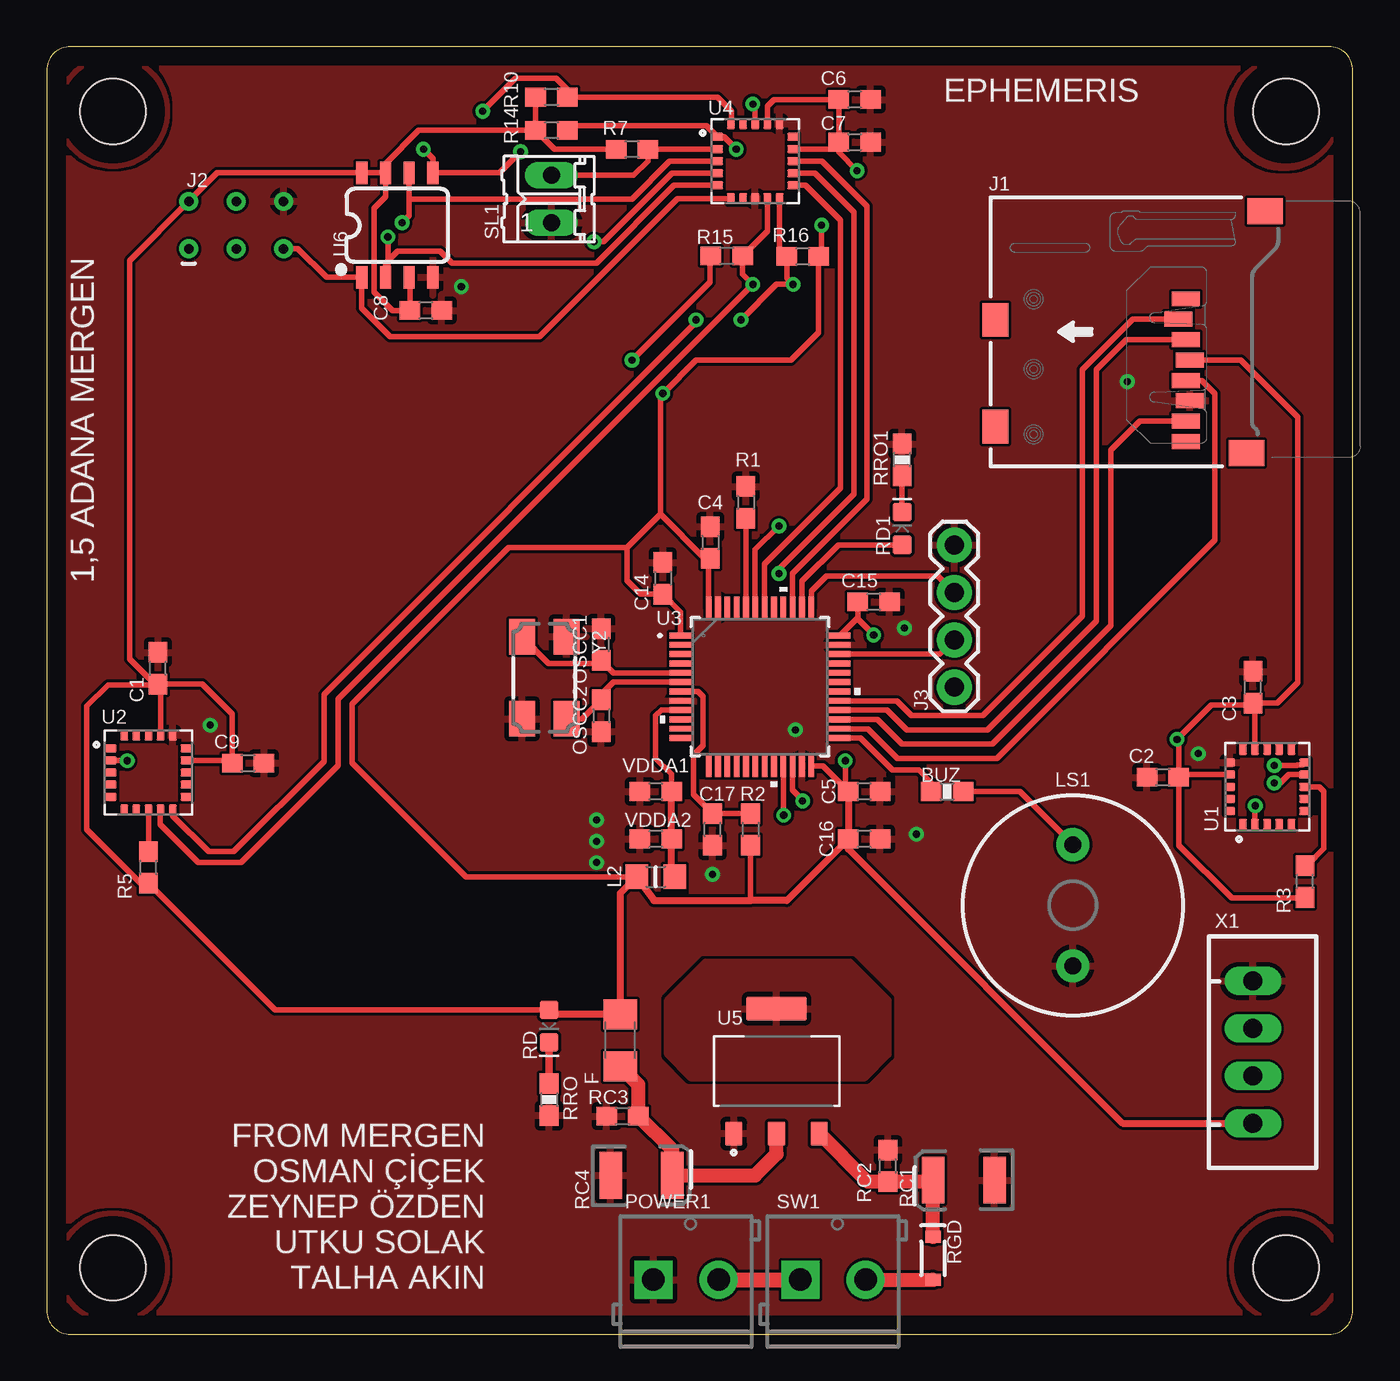
[diagram p7: board, top side]
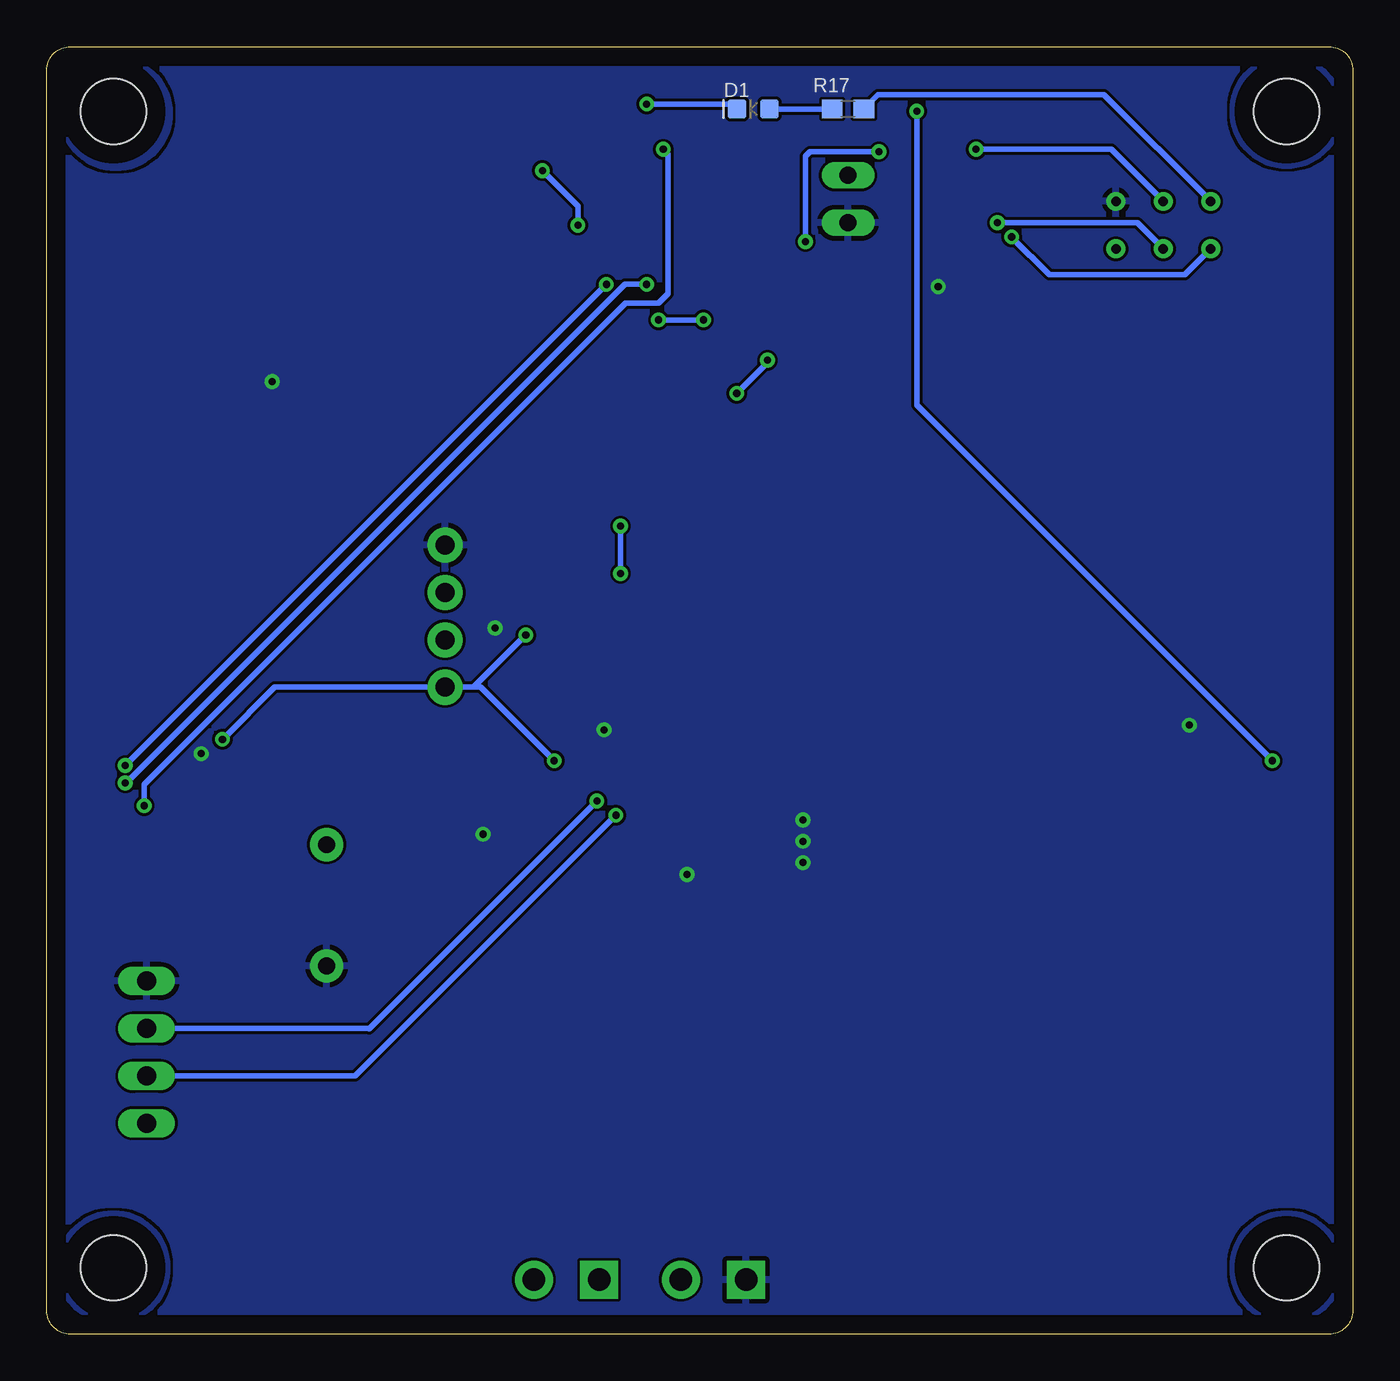
[diagram p8: board, bottom side, seen from below]

Size 70 x 69 mm. Coordinates in mm from the lower left corner, seen from the top.
Outline: 0,67.73 0,1.27 arc90 1.27,0 68.73,0 arc90 70,1.27 70,67.73 arc90 68.73,69 1.27,69 arc90 0,67.73
Copper layers (1*16): Top 0.035mm / dielectric 1.5mm / Bottom 0.035mm
Design rules "default": minimum track width 6mil, minimum drill 0.35mm, track to track 6mil, track to pad 6mil, pad to pad 6mil, via to via 6mil, smd to smd 6mil, copper to edge 40mil, drill to drill 6mil, minimum pad ring 10mil, minimum via ring 8mil, stop-mask expansion 4mil, vias tented up to drill 0mil, thermal gap 10mil
Holes 3.5 mm at 3.56,3.56 66.42,3.56 66.42,65.53 3.56,65.53

### Footprints (pad centres in the part's own frame; a part is rotated, then mirrored left to right if it is on the bottom)
0603-RES = smd 1.1 x 1: 1 -0.85,0; 2 0.85,0
0603 = smd 1.1 x 1: 1 -0.85,0; 2 0.85,0
LED-0603 = smd 1 x 1: A -0.877,0; C 0.877,0
1206 = smd 1.6 x 1.8: 1 -1.4,0; 2 1.4,0
CON-SD-CARD_2908-05 = smd 0.8 x 1.5: 1 1.761,3.847; 2 0.669,4.253; 3 -0.423,3.847; 4 -1.515,3.644; 5 -2.607,3.847; 6 -3.7,3.644; 7 -4.792,3.847; 8 -5.884,3.847 | smd 1.397 x 1.905: GND@1 -6.5,0.6; GND@2 6.473,-0.389 | smd 1.803 x 1.397: GND@3 0.631,14.059; GND@4 -5.084,14.059
2X3_TEST_POINTS = drill 0.508: 1 -2.54,-1.27; 2 -2.54,1.27; 3 0,-1.27; 4 0,1.27; 5 2.54,-1.27; 6 2.54,1.27
1X04 = drill 1.016 pad 1.88: 1 0,0; 2 2.54,0; 3 5.08,0; 4 7.62,0
RC-MASTER-SMD_L0805MP = smd 1.2 x 1.3: 1 -1.016,0; 2 1.016,0
BUZZER-12MM = drill 0.9 pad 1.778: + 3.25,0; - -3.25,0
SCREWTERMINAL-3.5MM-2-NS = drill 1.2 pad 2.032 square: 1 0,0 | drill 1.2 pad 2.032: 2 3.5,0
EIA3528 = smd 1.2 x 2.5: A 1.65,0; C -1.65,0
SOD-323 = smd 0.63 x 0.83: A 1.15,0; C -1.15,0
02P = drill 0.914 long: 1 -1.27,0; 2 1.27,0
PQFN65P470X450X270-20N = smd 0.59 x 0.43: 1 -2.01,1.3; 2 -2.01,0.65; 3 -2.01,0; 4 -2.01,-0.65; 5 -2.01,-1.3; 11 2.01,-1.3; 12 2.01,-0.65; 13 2.01,0; 14 2.01,0.65; 15 2.01,1.3 | smd 0.43 x 0.59: 6 -1.3,-2.01; 7 -0.65,-2.01; 8 0,-2.01; 9 0.65,-2.01; 10 1.3,-2.01; 16 1.3,2.01; 17 0.65,2.01; 18 0,2.01; 19 -0.65,2.01; 20 -1.3,2.01
LQFP48-7X7MM = smd 1.194 x 0.305: 1 -4.25,2.75; 2 -4.25,2.25; 3 -4.25,1.75; 4 -4.25,1.25; 5 -4.25,0.75; 6 -4.25,0.25; 7 -4.25,-0.25; 8 -4.25,-0.75; 9 -4.25,-1.25; 10 -4.25,-1.75; 11 -4.25,-2.25; 12 -4.25,-2.75; 25 4.25,-2.75; 26 4.25,-2.25; 27 4.25,-1.75; 28 4.25,-1.25; 29 4.25,-0.75; 30 4.25,-0.25; 31 4.25,0.25; 32 4.25,0.75; 33 4.25,1.25; 34 4.25,1.75; 35 4.25,2.25; 36 4.25,2.75 | smd 0.305 x 1.194: 13 -2.75,-4.25; 14 -2.25,-4.25; 15 -1.75,-4.25; 16 -1.25,-4.25; 17 -0.75,-4.25; 18 -0.25,-4.25; 19 0.25,-4.25; 20 0.75,-4.25; 21 1.25,-4.25; 22 1.75,-4.25; 23 2.25,-4.25; 24 2.75,-4.25; 37 2.75,4.25; 38 2.25,4.25; 39 1.75,4.25; 40 1.25,4.25; 41 0.75,4.25; 42 0.25,4.25; 43 -0.25,4.25; 44 -0.75,4.25; 45 -1.25,4.25; 46 -1.75,4.25; 47 -2.25,4.25; 48 -2.75,4.25
SOT229P700X180-4N = smd 0.93 x 1.31: 1 -2.29,-3.345; 2 0,-3.345; 3 2.29,-3.345 | smd 3.24 x 1.31: 4 0,3.345
SO08 = smd 0.6 x 1.2: 1 -1.905,-2.8; 2 -0.635,-2.8; 3 0.635,-2.8; 4 1.905,-2.8; 5 1.905,2.8; 6 0.635,2.8; 7 -0.635,2.8; 8 -1.905,2.8
JST-XH-04-PACKAGE-LONG-PAD = drill 1.016 long: 1 -3.81,0; 2 -1.27,0; 3 1.27,0; 4 3.81,0
OSCCC500X320X110-4N = smd 1.9 x 1.4: 1 -2.2,-1.2; 2 2.2,-1.2; 3 2.2,1.2; 4 -2.2,1.2

### Placement (x,y rotation side)
BUZ  48.26,29.08 0 top
C1  5.97,35.69 90 top
C2  59.82,29.84 180 top
C3  64.64,34.67 90 top
C4  35.56,42.42 270 top
C5  43.81,29.08 180 top
C6  43.31,66.17 0 top
C7  43.31,63.88 0 top
C8  20.32,54.86 0 top
C9  10.79,30.61 0 top
C14  33.02,40.51 270 top
C15  44.32,39.24 180 top
C16  43.81,26.54 180 top
C17  35.69,27.05 90 top
D1  32.13,65.66 180 bottom
F  30.73,15.75 90 top
J1  64.9,53.72 90 top
J2  10.16,59.44 0 top
J3  48.64,34.67 90 top
L2  [RC-MASTER-SMD_L0805MP]  32.64,24.51 0 top
LS1  54.99,22.99 90 top
OSCC1  29.72,36.96 90 top
OSCC2  29.72,33.15 270 top
POWER1  32.51,2.92 0 top
R1  37.47,44.58 270 top
R2  37.72,27.05 270 top
R3  67.44,24.26 90 top
R5  5.46,25.02 90 top
R7  31.37,63.5 180 top
R10  27.05,66.29 180 top
R14  27.05,64.52 180 top
R15  36.45,57.78 180 top
R16  40.51,57.76 0 top
R17  27.05,65.66 180 bottom
RC1  49.15,8.26 180 top
RC2  45.09,9.02 90 top
RC3  30.86,11.68 180 top
RC4  31.88,8.51 0 top
RD  26.92,16.51 270 top
RD1  45.85,43.18 90 top
RGD  47.5,4.06 270 top
RRO  26.92,12.57 270 top
RRO1  45.85,46.86 90 top
SL1  27.05,60.83 90 top
SW1  40.39,2.92 0 top
U1  65.41,29.34 90 top
U2  5.46,30.1 0 top
U3  38.23,34.7 0 top
U4  37.97,62.87 0 top
U5  39.12,14.1 0 top
U6  18.8,59.44 0 top
VDDA1  32.64,29.08 180 top
VDDA2  32.64,26.54 180 top
X1  64.64,15.11 270 top
Y2  26.67,35.18 270 top

### Tracks (layer width: path | path; a pad name or v marks a point on that pad's centre or on a via)
3.3V  (via drill 0.38)
  Top 0.305: U2.14 9.8,30.75 C9.1 9.95,33.23 8.34,34.84 C1.1 6.01,34.8 | U2.17 6.11,34.7 6.01,34.8 | 64.75,33.71 C3.1 65.95,33.82 67.06,34.92 67.06,49.15 64,52.21 J1.4 | 64.75,33.71 U1.14 | U1.17 60.81,29.99 C2.1 | U4.17 38.62,65.8 38.99,66.17 C6.1 C7.1 | RD.A 12.24,17.39 R5.1 5.04,24.17 2.16,27.05 2.16,33.66 3.3,34.8 5.84,34.8 | R2.2 37.72,23.24 | U3.36 42.5,37.45 43.47,38.42 C15.2 43.47,38.31 v44.32,37.47 | U3.24 41.6,30.45 C5.2 | U6.3 19.47,56.6 C8.1 18.54,54.86 17.56,55.85 17.56,60.35 18.16,60.96 U6.7 | R14.2 27.22,63.5 R7.2 | R10.2 R14.2 | C2.1 60.67,31.79 v60.58,31.88 62.41,33.71 64.75,33.71 | C2.1 60.67,26.2 63.5,23.37 67.4,23.37 R3.1 | L2.1 22.48,24.51 16.38,30.61 16.38,33.78 24.77,42.16 31.11,42.16 | 32.89,43.94 32.89,50.29 v33.02,50.42 34.8,52.2 39.88,52.2 41.36,53.68 R16.2 41.53,57.93 v41.53,59.44 | v31.37,52.2 35.56,56.39 35.56,57.75 R15.2 | U6.7 U6.8 9.15,62.24 J2.2 4.45,57.53 4.45,36.2 5.84,34.8 | U6.7 18.16,62.74 19.94,64.52 R14.2 | 5.84,34.8 6.01,34.8 | v42.8,30.73 42.8,29 42.97,28.83 | 31.11,42.16 32.89,43.94 | U3.48 35.48,41.48 C4.2 35.27,41.57 32.89,43.94 | U3.1 33.98,38.71 C14.2 31.84,39.66 31.11,40.39 31.11,42.16 | U4.14 42.09,63.52 C7.1 | v43.43,62.36 42.46,63.33 C7.1
  Top 0.381: RD.A 27.16,17.15 F.2 30.73,23.62 L2.1 32.54,23.24 37.72,23.24 39.66,23.24 C16.2 | C5.2 42.97,28.83 C16.2 | C16.2 42.97,26 57.66,11.3 X1.4
  Bottom 0.305: J3.1 57.78,34.67 v60.58,31.88 | v33.02,50.42 31.37,52.07 v31.37,52.2 | v41.53,59.44 41.53,60.45 v43.43,62.36 | J2.2 13.33,66.42 25.44,66.42 R17.1 | J3.1 47.12,34.67 v44.32,37.47 | J3.1 46.74,34.67 v42.8,30.73
BT0
  Top 0.305: R1.2 37.48,43.72 U3.44
BUZZER
  Top 0.305: U3.25 43.62,31.95 45.34,30.23 46.74,30.23 47.41,29.55 BUZ.1
CMISO  (via drill 0.38)
  Top 0.305: U4.5 33.62,61.56 29.46,57.4 21.72,57.4 21.08,58.04 18.8,58.04 18.16,57.4 U6.2 18.29,56.76 v18.29,58.8
  Bottom 0.305: J2.1 9.02,56.77 16.26,56.77 v18.29,58.8
CMOSI  (via drill 0.38)
  Top 0.305: v20.19,63.5 20.7,62.99 U6.5 24.26,62.24 v25.4,63.37 | v29.34,58.55 29.83,58.55 33.52,62.23 35.95,62.23 U4.4
  Bottom 0.305: J2.4 12.95,63.5 v20.19,63.5 | v25.4,63.37 29.08,63.37 29.34,63.12 v29.34,58.55
CS
  Top 0.305: J1.2 58.2,54.39 55.5,51.69 55.5,38.48 50.16,33.15 46.35,33.15 45.56,33.95 U3.29
CSCK  (via drill 0.38)
  Top 0.305: U4.3 33.39,62.86 31.36,60.83 19.43,60.83 | 19.43,60.83 U6.6 | v19.05,59.56 19.43,59.94 19.43,60.83
  Bottom 0.305: J2.3 11.56,59.56 v19.05,59.56
CSN_EE
  Top 0.305: U4.6 33.81,60.86 26.42,53.47 18.41,53.47 16.89,54.99 U6.1 14.99,56.64 13.46,58.17 J2.5
GND  (via drill 0.38)
  other vias: 57.91,51.05 61.72,31.11 8.76,32.64 22.23,56.13 35.69,24.64 29.46,27.56 29.46,26.42 29.46,25.27 46.61,26.8 40.13,32.38 45.97,37.85
  pour Top (rank 2): -0.25,69.22 -0.25,-0.25 70.23,-0.25 70.23,69.22
  pour Bottom (rank 2): -0.51,69.34 -0.51,-0.64 70.36,-0.64 70.36,69.34
HT
  pour Top: 35.31,19.94 43.05,19.94 45.09,17.91 45.09,14.99 43.81,13.72 34.54,13.72 33.27,14.99 33.27,17.91
  pour Top: 6.55,65.53 6.55,65.56 arc90 3.58,68.53 3.53,68.53 arc90 0.56,65.56 0.56,65.53 arc90 3.56,62.53 arc90
HT1
  pour Bottom: 0.56,65.53 0.56,65.56 arc-90 3.53,68.53 3.58,68.53 arc-90 6.55,65.56 6.55,65.53 arc-90 3.56,62.53 arc-90
HT2
  pour Top: 69.29,65.41 69.29,65.43 arc90 66.32,68.4 66.27,68.4 arc90 63.3,65.43 63.3,65.41 arc90 66.29,62.41 arc90
HT3
  pour Bottom: 63.3,65.41 63.3,65.43 arc-90 66.27,68.4 66.32,68.4 arc-90 69.29,65.43 69.29,65.41 arc-90 66.29,62.41 arc-90
HT4
  pour Top: 69.29,65.41 69.29,65.43 arc90 66.32,68.4 66.27,68.4 arc90 63.3,65.43 63.3,65.41 arc90 66.29,62.41 arc90
HT5
  pour Bottom: 63.3,65.41 63.3,65.43 arc-90 66.27,68.4 66.32,68.4 arc-90 69.29,65.43 69.29,65.41 arc-90 66.29,62.41 arc-90
HT6
  pour Top: 6.55,3.56 6.55,3.58 arc90 3.58,6.55 3.53,6.55 arc90 0.56,3.58 0.56,3.56 arc90 3.56,0.56 arc90
HT7
  pour Bottom: 0.56,3.56 0.56,3.58 arc-90 3.53,6.55 3.58,6.55 arc-90 6.55,3.58 6.55,3.56 arc-90 3.56,0.56 arc-90
HT8
  pour Top: 6.55,3.56 6.55,3.58 arc90 3.58,6.55 3.53,6.55 arc90 0.56,3.58 0.56,3.56 arc90 3.56,0.56 arc90
HT9
  pour Bottom: 0.56,3.56 0.56,3.58 arc-90 3.53,6.55 3.58,6.55 arc-90 6.55,3.58 6.55,3.56 arc-90 3.56,0.56 arc-90
HT10
  pour Top: 69.42,3.56 69.42,3.58 arc90 66.45,6.55 66.4,6.55 arc90 63.42,3.58 63.42,3.56 arc90 66.42,0.56 arc90
HT11
  pour Bottom: 63.42,3.56 63.42,3.58 arc-90 66.4,6.55 66.45,6.55 arc-90 69.42,3.58 69.42,3.56 arc-90 66.42,0.56 arc-90
HT12
  pour Top: 69.42,3.56 69.42,3.58 arc90 66.45,6.55 66.4,6.55 arc90 63.42,3.58 63.42,3.56 arc90 66.42,0.56 arc90
HT13
  pour Bottom: 63.42,3.56 63.42,3.58 arc-90 66.4,6.55 66.45,6.55 arc-90 69.42,3.58 69.42,3.56 arc-90 66.42,0.56 arc-90
INT
  Top 0.305: U4.13 41.55,62.86 43.97,60.45 43.97,44.76 39.98,40.77 U3.39
LED
  Top 0.305: U3.38 40.48,40.35 42.43,42.3 RD1.A
LED_IND  (via drill 0.38)
  Top 0.305: U4.18 37.97,65.8 v37.85,65.92
  Bottom 0.305: D1.C 33.27,65.92 v37.85,65.92
MISO
  Top 0.305: J1.7 58.58,48.93 57.02,47.37 57.02,37.97 50.67,31.62 45.85,31.62 44.52,32.95 U3.27
MOSI
  Top 0.305: J1.3 57.87,53.3 56.26,51.69 56.26,38.23 50.42,32.38 46.1,32.38 45.04,33.45 U3.28
N$1
  Top 0.305: U1.8 68.2,29.34 68.45,29.08 68.45,26.04 67.53,25.11 R3.2
N$2
  Top 0.305: RD1.C RRO1.1
N$3
  Top 0.813: POWER1.2 SW1.1
N$5
  Top 0.305: U2.8 R5.2
N$6
  Top 0.762: U5.2 39.12,9.65 37.97,8.51 RC4.A 33.53,9.87 RC3.1 31.71,13.37 F.1
N$11
  Top 0.406: RD.C RRO.1
N$13
  Top 0.305: BUZ.2 52.15,29.08 LS1.+
N$14
  Bottom 0.305: D1.A R17.2
NRST
  Top 0.305: R2.1 C17.2 34.67,28.92 34.67,31.04 35.18,31.55 35.18,34.16 34.9,34.45 U3.7
OSC_IN
  Top 0.305: Y2.1 26.91,35.94 29.55,35.94 OSCC1.1 30.38,35.45 U3.5
OSC_OUT
  Top 0.305: Y2.3 28.7,32.98 OSCC2.1 29.72,34.29 30.37,34.95 U3.6
RESN
  Top 0.305: U4.2 32.23,63.52 R7.1 32.22,62.87 31.46,62.1 SL1.2
RX_S
  Top 0.305: U4.11 40.67,61.56 42.55,59.69 42.55,45.34 38.48,41.27 U3.42
RX_T  (via drill 0.38)
  Top 0.305: v39.5,27.81 39.48,27.83 U3.21
  Bottom 0.305: X1.3 53.47,13.84 v39.5,27.81
SCK
  Top 0.305: J1.5 61.92,51.11 62.61,50.42 62.61,42.55 50.93,30.86 45.59,30.86 44.01,32.45 U3.26
SCL_M  (via drill 0.38)
  Top 0.305: U4.9 38.62,59.11 R15.1 37.3,56.81 v37.85,56.26 15.62,34.04 15.62,30.48 10.41,25.27 8.13,25.27 6.1,27.3 6.1,28.07 U2.9 | U1.9 66.56,29.99 66.12,29.54 v65.79,29.54
  Bottom 0.305: v65.79,29.54 65.55,29.78 65.5,29.78 39.02,56.26 v37.85,56.26
SDA_M  (via drill 0.38)
  Top 0.305: U4.10 39.27,58.15 R16.1 39.66,56.6 v40.01,56.26 39.12,56.26 v37.21,54.36 | U1.10 67.28,30.51 67.03,30.51 67,30.48 v65.79,30.48 | U2.10 6.76,27.78 8.69,25.86 10.03,25.86 14.86,30.68 14.86,34.29 34.8,54.23 v34.8,54.36
  Bottom 0.305: v65.79,30.48 v40.01,56.26 | v37.21,54.36 v34.8,54.36
SLV1_R  (via drill 0.38)
  Top 0.305: R14.1 28.16,64.77 35.36,64.77 U4.1 36.29,64.17 v36.96,63.5 | U1.2 64.75,28.31 v64.77,28.32
  Bottom 0.305: v64.77,28.32 64.77,29.46 38.99,55.24 37.21,55.24 36.7,55.75 36.7,63.25 v36.96,63.5
SLV2_R  (via drill 0.38)
  Top 0.305: U4.20 36.7,64.91 36.7,65.53 35.94,66.29 R10.1 27.9,66.71 27.3,67.31 25.14,67.31 v23.37,65.54 | U2.2 4.3,30.75 v4.32,30.73
  Bottom 0.305: v4.32,30.73 23.37,49.78 v23.37,65.54
SWCLK
  Top 0.305: U3.37 40.98,39.83 41.78,40.64 47.75,40.64 J3.3
SWDIO
  Top 0.305: U3.34 47.88,36.45 J3.2
TX_S  (via drill 0.38)
  Top 0.305: U4.12 41.18,62.21 43.26,60.13 43.26,45.02 39.24,41.01 v39.24,40.77 | U3.43 37.97,42.04 v39.24,43.31
  Bottom 0.305: v39.24,43.31 v39.24,40.77
TX_T  (via drill 0.38)
  Top 0.305: v40.51,28.57 40.51,28.63 39.98,29.16 U3.22
  Bottom 0.305: v40.51,28.57 52.72,16.37 52.74,16.38 X1.2
VDDA
  Top 0.305: VDDA1.1 33.49,30.01 32.64,30.86 32.64,33.15 32.94,33.45 U3.9
  Top 0.381: L2.2 33.49,24.71 VDDA2.1 VDDA1.1
VIN
  Top 0.762: SW1.2 47.49,2.92 RGD.A
VNR
  Top 0.762: RGD.C RC1.A 47.41,8.17 RC2.1 43.99,8.17 U5.3

### Text on the board
tPlace: EPHEMERIS | 1,5 ADANA MERGEN | FROM MERGEN / OSMAN ÇİÇEK / ZEYNEP ÖZDEN / UTKU SOLAK / TALHA AKIN